# Altium project LCDTestor_LPC1788.PRJPCB
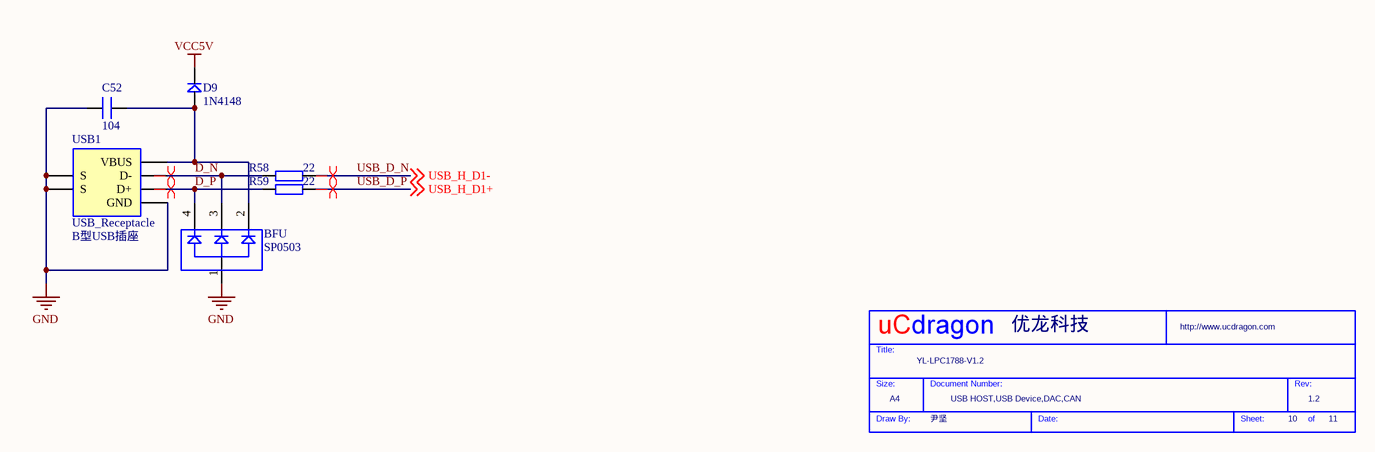
[diagram p0: 10)USB HOST,USB Device,.SchDoc]
9 sheets, 173 parts. Net scope: global (net labels, ports and power ports of the same name join across sheets).
Board file: LCDTestor_LPC1788.PcbDoc
Sheets:
  10)USB HOST,USB Device,.SchDoc
  07)Power,JTAG,RESET.SchDoc
  06)LCD.SchDoc
  05)NorFlash,NandFlash.SchDoc
  04)SDRAM.SchDoc
  03)CPU-3.SchDoc
  02)CPU-2.SchDoc
  01)CPU-1.SchDoc
  11)KEY,LED.SchDoc

## Sheet 10)USB HOST,USB Device,.SchDoc
size 297 x 209 mm

### Parts
(Parts that share a designator on the sheet are numbered #1, #2 ... from top to bottom, then left to right.)
*#1  Page Count: 11  Page Number: 10  Page Size: A4  Title: YL-LPC1788-V1.2  RevCode: 1.2  Doc: USB HOST,USB Device,DAC,CAN  Drawing: 尹坚  Company: 优龙科技  (hidden comment: My Title 0)  (graphical)
BFU  SP0503  [SOT143]
C52  104  [0603P]
D9  1N4148  [DIODE_SOP]
R58  22  [0603P]
R59  22  [0603P]
USB1  USB_Receptacle  value B型USB插座  [Micro_USB]

### Nets
GND: BFU.1 C52.1 USB1.4(GND) USB1.5(S) USB1.6(S)
VCC5V: D9.2
D_N: BFU.3 R58.1 USB1.2(D-)
D_P: BFU.4 R59.1 USB1.3(D+)
USB_D_N: R58.2 ; off-sheet USB_H_D1-  [also labelled USB_H_D1-]
USB_D_P: R59.2 ; off-sheet USB_H_D1+  [also labelled USB_H_D1+]
NetBFU_2: BFU.2 C52.2 D9.1 USB1.1(VBUS)

### Layout directives
differential pair: (no net found under the mark), USB_D_N, USB_D_P

### Notes on the sheet
- (in symbol My Title 0) Title:; Size:; Document Number:; Rev:; Draw By:; Date:; Sheet:; of

### Library data of the parts
BFU = SP0503: Capacitor; Published: *; Publisher: *; Manufacturer: *; Class: *; SubClass: *; Value: *
C52 = C_2
D9 = D
R58 R59 = R
USB1 = 300008272: B型USB插座，Series “B” Receptacles，Right Angle, T/H，4POS; Part name: USB插座; ID: 273; Part Number: 300008272; Part Type: USB插座; DataSheet: \\dsvr\1_研发团队\1_研发资源\HW\Lib_Datasheet\conn\usb\UC11123-LK1-4F_B_type.pdf
*#1 = My Title 0: Page Create Date: May 29, 2006; WebSite: http://www.ucdragon.com

## Sheet 07)Power,JTAG,RESET.SchDoc
size 297 x 209 mm
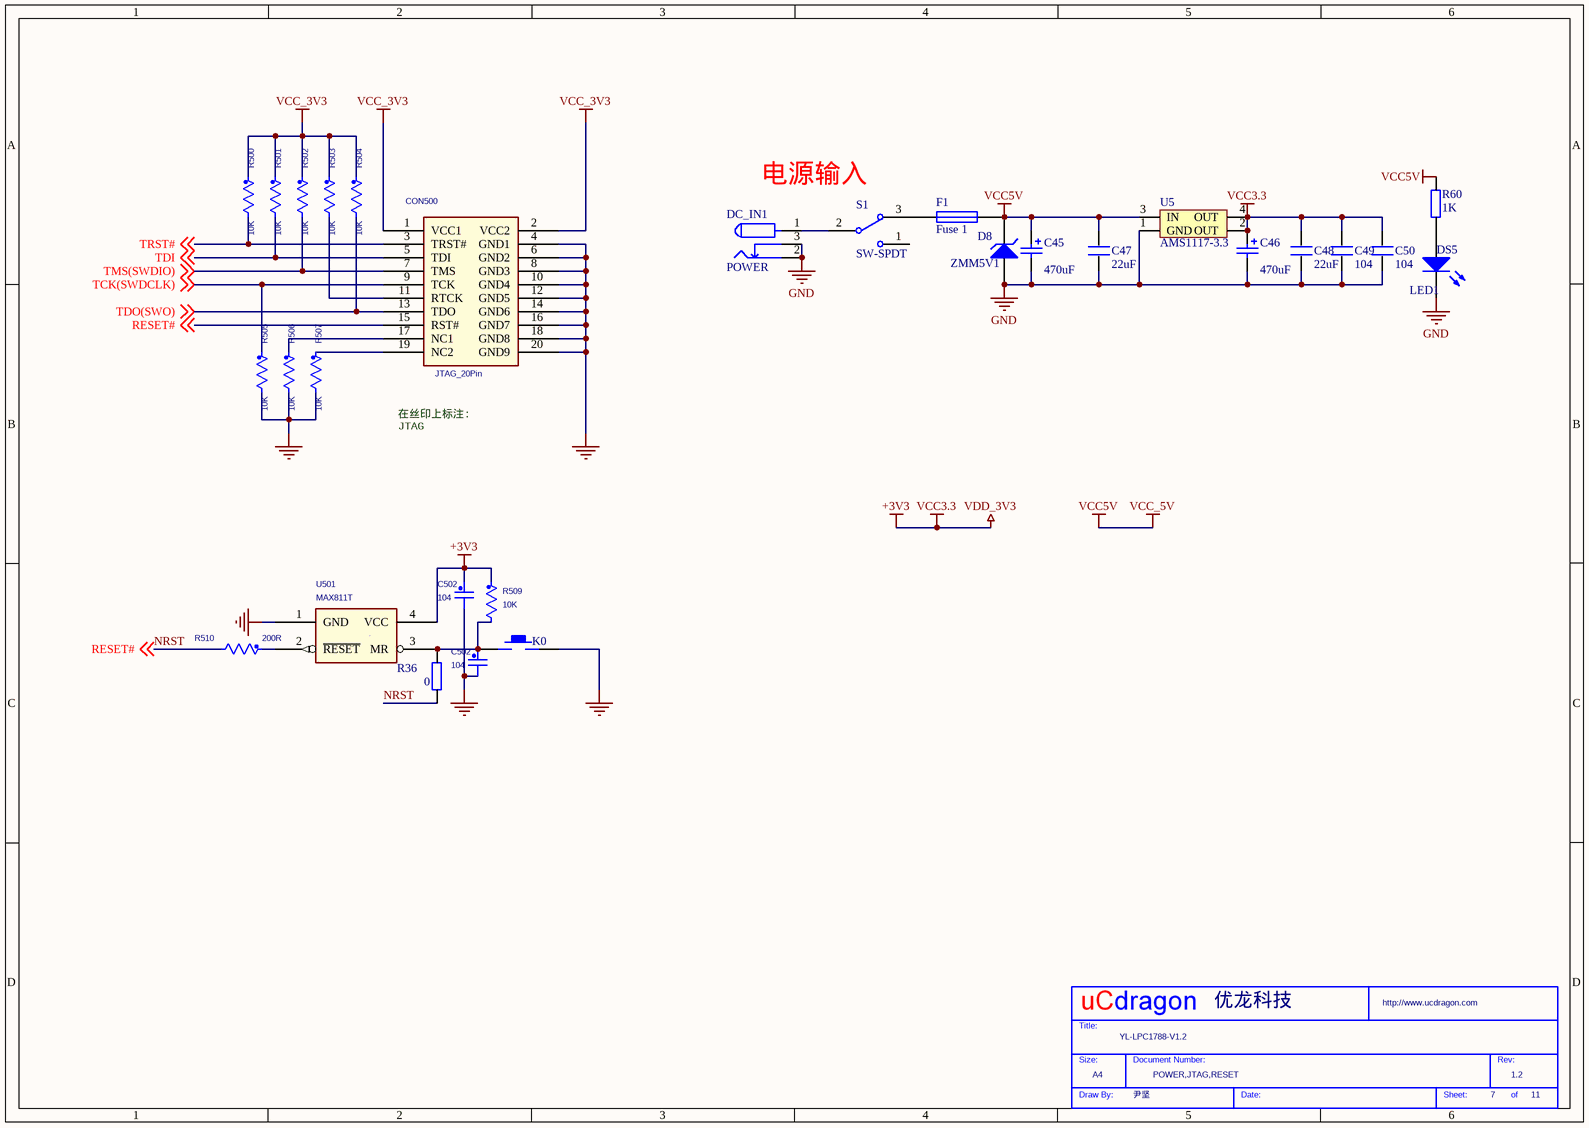
[diagram p1: 07)Power,JTAG,RESET.SchDoc]

### Parts
(Parts that share a designator on the sheet are numbered #1, #2 ... from top to bottom, then left to right.)
*#2  Page Count: 11  Page Number: 7  Page Size: A4  Title: YL-LPC1788-V1.2  RevCode: 1.2  Doc: POWER,JTAG,RESET  Drawing: 尹坚  Company: 优龙科技  (hidden comment: My Title 0)  (graphical)
C45  value 470uF  [7343]  (hidden comment: Cap Tantalum)
C46  value 470uF  [7343]  (hidden comment: Cap Tantalum)
C47  22uF  [0603P]
C48  22uF  [0603P]
C49  104  [0603P]
C50  104  [0603P]
C502#1  104  [0603P]
C502#2  104  [0603P]
CON500  JTAG_20Pin  [JTAG_20]
D8  ZMM5V1  [LL-34]
DC_IN1  POWER  [DC10B]
DS5  LED1  [SMDLED]
F1  Fuse 1  [0805]
K0  KEY_M  [K贴片]  (value not drawn)
R36  0  [0603P]
R60  1K  [0603P]
R500  10K  [0603P]
R501  10K  [0603P]
R502  10K  [0603P]
R503  10K  [0603P]
R504  10K  [0603P]
R505  10K  [0603P]
R506  10K  [0603P]
R507  10K  [0603P]
R509  10K  [0603P]
R510  200R  [0603P]
S1  SW-SPDT  [自锁开关6]
U5  AMS1117-3.3  [AMS1117]
U501  MAX811T  [SOT143]

### Nets
+3V3: C46.1 C48.2 C49.2 C50.2 C502#1.1 R509.1 U5.2(OUT) U5.4(OUT) U501.4(VCC)  [also labelled VCC3.3, VDD_3V3]
GND: C45.2 C46.2 C47.1 C48.1 C49.1 C50.1 D8.1(A) DC_IN1.2 DC_IN1.3 DS5.2(K) U5.1(GND)
GND_POWER: C502#1.2 C502#2.2 CON500.4(GND1) CON500.6(GND2) CON500.8(GND3) CON500.10(GND4) CON500.12(GND5) CON500.14(GND6) CON500.16(GND7) CON500.18(GND8) CON500.20(GND9) K0.2 R505.2 R506.2 R507.2 U501.1(GND)
VCC5V: C45.1 C47.2 D8.2(K) F1.2 R60.1 U5.3(IN)  [also labelled VCC_5V]
VCC_3V3: CON500.1(VCC1) CON500.2(VCC2) R500.1 R501.1 R502.1 R503.1 R504.1
NRST: CON500.15(RST#) R36.2 R510.2 ; off-sheet RESET#  [also labelled RESET#]
TCK(SWDCLK): CON500.9(TCK) R505.1 ; off-sheet TCK(SWDCLK)
TDI: CON500.5(TDI) R501.2 ; off-sheet TDI
TDO(SWO): CON500.13(TDO) R504.2 ; off-sheet TDO(SWO)
TMS(SWDIO): CON500.7(TMS) R502.2 ; off-sheet TMS(SWDIO)
TRST#: CON500.3(TRST#) R500.2 ; off-sheet TRST#
NetC502#2_1: C502#2.1 K0.1 R36.1 R509.2 U501.3(MR)
NetCON500_11: CON500.11(RTCK) R503.2
NetCON500_17: CON500.17(NC1) R506.1
NetCON500_19: CON500.19(NC2) R507.1
NetDC_IN1_1: DC_IN1.1 S1.2
NetDS5_1: DS5.1(A) R60.2
NetF1_1: F1.1 S1.3
NetR510_1: R510.1 U501.2(~{RESET})

Not connected (* = marked no-connect by the designer): S1 1

### Notes on the sheet
- 电源输入
- 在丝印上标注:
  JTAG
- (in symbol My Title 0) Title:; Size:; Document Number:; Rev:; Draw By:; Date:; Sheet:; of

### Library data of the parts
C45 C46 = Cap Tantalum: Polarized Capacitor (Surface Mount); Published: LatestRevisionDate; LatestRevisionDate: 2014-11-15; LatestRevisionNote: IPC-7351 Footprint Added.; PackageReference: C0805; Publisher: Am; PackageDescription: Chip Capacitor
C47-C50 = C_2
C502#1 C502#2 = C_Generic_Dup1: Dielectric: X7R; Mfg #1: KEMET; Voltage: 16V; P/N #1: C0603C104K4RAC; Toler.: 10%
D8 = D Zener: Zener Diode; Published: 8-Jun-2000; LatestRevisionDate: 17-Jul-2002; LatestRevisionNote: Re-released for DXP Platform.; PackageReference: DIODE-0.7; Publisher: Altium Limited
DC_IN1 = POW
DS5 = LED2: Typical RED, GREEN, YELLOW, AMBER GaAs LED; Published: 8-Jun-2000; LatestRevisionDate: 17-Jul-2002; LatestRevisionNote: Re-released for DXP Platform.; PackageDocument: Feb-2002; PackageReference: 3.2X1.6X1.1; Publisher: Altium Limited
F1 = Fuse 1: Fuse; Published: 8-Jun-2000; LatestRevisionDate: 17-Jul-2002; LatestRevisionNote: Re-released for DXP Platform.; PackageReference: PIN-W2/E2.8; Publisher: Altium Limited
R36 R60 = R
R500-R507 R509 R510 = R_Generic_Dup1: Toler.: 1%; Watts: 0.1W; P/N #1: CR10-1001F-T; Mfg #1: AVX
S1 = SW-SPDT: SPDT Subminiature Toggle Switch, Right Angle Mounting, Vertical Actuation; Published: 24-Mar-1999; LatestRevisionDate: 17-Dec-2003; LatestRevisionNote: Schematic revised, PCB Footprint replaced.; DatasheetVersion: 05-Dec-2000; PackageReference: TL36WW15050; Publisher: Altium Limited; ComponentLink1Description: Manufacturer Link; ComponentLink1URL: http://www.apem.com
U5 = AMS1117
U501 = UD215_1
*#2 = My Title 0: Page Create Date: May 29, 2006; WebSite: http://www.ucdragon.com

## Sheet 06)LCD.SchDoc
size 292 x 193 mm
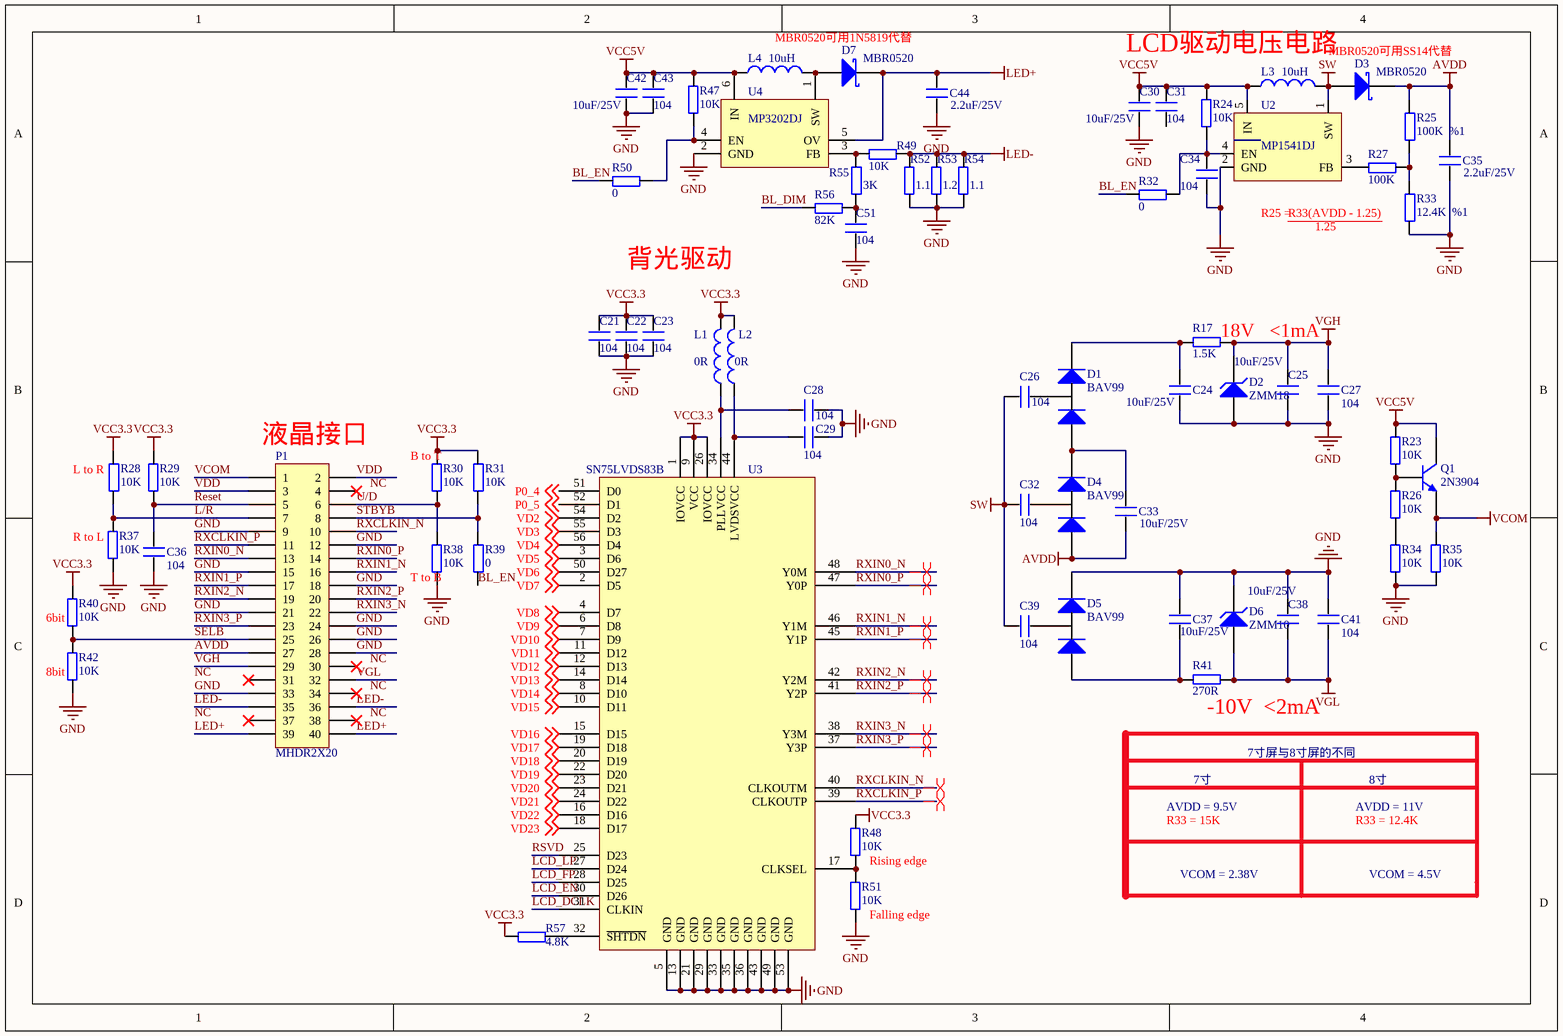
[diagram p2: 06)LCD.SchDoc]

### Parts
C21  104  [0603P]
C22  104  [0603P]
C23  104  [0603P]
C24  10uF/25V  [1206]
C25  10uF/25V  [1206]
C26  104  [0603P]
C27  104  [0603P]
C28  104  [0603P]
C29  104  [0603P]
C30  10uF/25V  [1206]
C31  104  [0603P]
C32  104  [0603P]
C33  10uF/25V  [1206]
C34  104  [0603P]
C35  2.2uF/25V  [1206]
C36  104  [0603P]
C37  10uF/25V  [1206]
C38  10uF/25V  [1206]
C39  104  [0603P]
C41  104  [0603P]
C42  10uF/25V  [1206]
C43  104  [0603P]
C44  2.2uF/25V  [1206]
C51  104  [0603P]
D1  BAV99  [SOT-23-3L]
D2  ZMM18  [LL-34]
D3  MBR0520  [DSO-C2/X2.3]
D4  BAV99  [SOT-23-3L]
D5  BAV99  [SOT-23-3L]
D6  ZMM10  [LL-34]
D7  MBR0520  [DSO-C2/X2.3]
L1  value 0R  [0603P]  (hidden comment: Inductor)
L2  value 0R  [0603P]  (hidden comment: Inductor)
L3  value 10uH  [1206]  (hidden comment: Inductor)
L4  value 10uH  [1206]  (hidden comment: Inductor)
P1  MHDR2X20  [FH12A-40S-0.5SH]
Q1  2N3904  [SOT-23-3L]
R17  1.5K  [0603P]
R23  10K  [0603P]
R24  10K  [0603P]
R25  100K  %1  [0603P]
R26  10K  [0603P]
R27  100K  [0603P]
R28  10K  [0603P]
R29  10K  [0603P]
R30  10K  [0603P]
R31  10K  [0603P]
R32  0  [0603P]
R33  12.4K  %1  [0603P]
R34  10K  [0603P]
R35  10K  [0603P]
R37  10K  [0603P]
R38  10K  [0603P]
R39  0  [0603P]
R40  10K  [0603P]
R41  270R  [0603P]
R42  10K  [0603P]
R47  10K  [0603P]
R48  10K  [0603P]
R49  10K  [0603P]
R50  0  [0603P]
R51  10K  [0603P]
R52  1.1  [0603P]
R53  1.2  [0603P]
R54  1.1  [0603P]
R55  3K  [0603P]
R56  82K  [0603P]
R57  4.8K  [0603P]
U2  MP1541DJ  [SOT-23-5L]
U3  SN75LVDS83B  [DGG056]
U4  MP3202DJ  [SOT-23-6L]

### Nets
AVDD: C33.2 C35.1 D3.2(K) D4.1(A) P1.27 R25.2
GND: C21.1 C22.1 C23.1 C24.2 C25.2 C27.2 C28.1 C29.1 C30.2 C34.1 C35.2 C36.1 C37.1 C38.1 C41.1 C42.2 C43.1 C44.2 C51.1 D2.1(A) D5.2(K) D6.2(K) P1.9 P1.12 P1.15 P1.18 P1.21 P1.24 P1.26 P1.28 P1.33 R33.1 R34.2 R35.2 R37.2 R38.2 R42.2 R51.2 R52.2 R53.2 R54.2 U2.2(GND) U3.5(GND) U3.13(GND) U3.21(GND) U3.29(GND) U3.33(GND) U3.35(GND) U3.36(GND) U3.43(GND) U3.49(GND) U3.53(GND) U4.2(GND)
LED+: C44.1 D7.2(K) P1.39 P1.40 U4.5(OV)
LED-: P1.35 P1.36 R49.2 R52.1 R53.1 R54.1
SW: C26.2 C32.1 C39.1 D3.1(A) L3.2 U2.1(SW)
VCC3.3: C21.2 C22.2 C23.2 L1.2 L2.2 R28.2 R29.1 R30.1 R31.2 R40.1 R48.1 R57.1 U3.1(IOVCC) U3.9(VCC) U3.26(IOVCC)  [project net +3V3]
VCC5V: C30.1 C31.2 C42.1 C43.2 L3.1 L4.1 Q1.3(C) R23.1 R24.1 R47.1 U2.5(IN) U4.6(IN)
VCOM: P1.1 Q1.2(E) R35.1
VGH: C25.1 C27.1 D2.2(K) P1.29 R17.1
VGL: C38.2 C41.2 D6.1(A) P1.32 R41.1
BL_DIM: R56.1
BL_EN: R32.1 R39.1 R50.1
L/R: P1.7 R28.1 R37.1
LCD_DCLK: U3.31(CLKIN)
LCD_EN: U3.30(D26)
LCD_FP: U3.28(D25)
LCD_LP: U3.27(D24)
P0_4: U3.51(D0) ; off-sheet P0_4
P0_5: U3.52(D1) ; off-sheet P0_5
Reset: C36.2 P1.5 R29.2
RSVD: U3.25(D23)
RXCLKIN_N: P1.10 U3.40(CLKOUTM)
RXCLKIN_P: P1.11 U3.39(CLKOUTP)
RXIN0_N: P1.13 U3.48(Y0M)
RXIN0_P: P1.14 U3.47(Y0P)
RXIN1_N: P1.16 U3.46(Y1M)
RXIN1_P: P1.17 U3.45(Y1P)
RXIN2_N: P1.19 U3.42(Y2M)
RXIN2_P: P1.20 U3.41(Y2P)
RXIN3_N: P1.22 U3.38(Y3M)
RXIN3_P: P1.23 U3.37(Y3P)
SELB: P1.25 R40.2 R42.1
STBYB: P1.8 R31.1 R39.2
U/D: P1.6 R30.2 R38.1
VD2: U3.54(D2) ; off-sheet VD2
VD3: U3.55(D3) ; off-sheet VD3
VD4: U3.56(D4) ; off-sheet VD4
VD5: U3.3(D6) ; off-sheet VD5
VD6: U3.50(D27) ; off-sheet VD6
VD7: U3.2(D5) ; off-sheet VD7
VD8: U3.4(D7) ; off-sheet VD8
VD9: U3.6(D8) ; off-sheet VD9
VD10: U3.7(D9) ; off-sheet VD10
VD11: U3.11(D12) ; off-sheet VD11
VD12: U3.12(D13) ; off-sheet VD12
VD13: U3.14(D14) ; off-sheet VD13
VD14: U3.8(D10) ; off-sheet VD14
VD15: U3.10(D11) ; off-sheet VD15
VD16: U3.15(D15) ; off-sheet VD16
VD17: U3.19(D18) ; off-sheet VD17
VD18: U3.20(D19) ; off-sheet VD18
VD19: U3.22(D20) ; off-sheet VD19
VD20: U3.23(D21) ; off-sheet VD20
VD21: U3.24(D22) ; off-sheet VD21
VD22: U3.16(D16) ; off-sheet VD22
VD23: U3.18(D17) ; off-sheet VD23
VDD: P1.2 P1.3
NetC24_1: C24.1 D1.2(K) R17.2
NetC26_1: C26.1 D1.3(A)
NetC28_2: C28.2 L1.1 U3.34(PLLVCC)
NetC29_2: C29.2 L2.1 U3.44(LVDSVCC)
NetC32_2: C32.2 D4.3(A)
NetC33_1: C33.1 D1.1(A) D4.2(K)
NetC34_2: C34.2 R24.2 R32.2 U2.4(EN)
NetC37_2: C37.2 D5.1(A) R41.2
NetC39_2: C39.2 D5.3(A)
NetC51_2: C51.2 R55.1 R56.2
NetD7_1: D7.1(A) L4.2 U4.1(SW)
NetQ1_1: Q1.1(B) R23.2 R26.1
NetR25_1: R25.1 R27.2 R33.2
NetR26_2: R26.2 R34.1
NetR27_1: R27.1 U2.3(FB)
NetR47_2: R47.2 R50.2 U4.4(EN)
NetR48_2: R48.2 R51.1 U3.17(CLKSEL)
NetR49_1: R49.1 R55.2 U4.3(FB)
NetR57_2: R57.2 U3.32(~{SHTDN})

Not connected (* = marked no-connect by the designer): C31 1; P1 4* 30* 31* 34* 37* 38*

### Layout directives
differential pair: RXCLKIN_N, RXCLKIN_P, RXIN0_N, RXIN0_P, RXIN1_N, RXIN1_P, RXIN2_N, RXIN2_P, RXIN3_N, RXIN3_P

### Notes on the sheet
- MBR0520可用1N5819代替
- LCD驱动电压电路
- MBR0520可用SS14代替
- R25 =
- R33(AVDD - 1.25)
- 1.25
- 背光驱动
- (near R17) 18V   <1mA
- (near P1) 液晶接口
- (near R28) L to R
- (near R30) B to T
- (near R37) R to L
- (near R38) T to B
- (near R40) 6bit
- (near R42) 8bit
- (near R41) -10V  <2mA
- 7寸
- 7寸屏与8寸屏的不同
- 8寸
- AVDD = 9.5V
- R33 = 15K
- AVDD = 11V
- R33 = 12.4K
- Rising edge
- (near R51) Falling edge
- VCOM = 2.38V
- VCOM = 4.5V
- Labels drawn without touching a wire or pin: NC

### Library data of the parts
C21-C39 C41-C44 C51 = C
D2 D6 = D Zener: Zener Diode; Published: 8-Jun-2000; LatestRevisionDate: 17-Jul-2002; LatestRevisionNote: Re-released for DXP Platform.; PackageReference: DIODE-0.7; Publisher: Altium Limited
D3 D7 = D Schottky: Schottky Diode; Published: 8-Jun-2000; LatestRevisionDate: 17-Jul-2002; LatestRevisionNote: Re-released for DXP Platform.; PackageReference: SMB; Publisher: Altium Limited; Code_JEDEC: DO-214-AA
L1-L4 = Inductor: Code_IEC: 1005; Published: 8-Jun-2000; LatestRevisionDate: 29-May-2009; LatestRevisionNote: IPC-7351 Footprint Added.; PackageReference: 0402-A; Publisher: Altium Limited; PackageDescription: Chip Inductor; Code_JEITA: 0402
P1 = MHDR2X20: Header, 20-Pin, Dual row; LatestRevisionDate: 17-Jul-2002; LatestRevisionNote: Re-released for DXP Platform.; Publisher: Altium Limited
Q1 = 2N3904: NPN General Purpose Amplifier; Published: 8-Jun-2000; LatestRevisionDate: 15-Jan-2003; LatestRevisionNote: PCB Footprint 'BCY-W3/D4.7' replaced; DatasheetVersion: 1997; PackageVersion: Sep-1998; PackageReference: TO-92A; Publisher: Altium Limited; Code_JEDEC: TO-92A; ComponentLink1Description: Manufacturer Link; ComponentLink1URL: http://www.fairchildsemi.com/; ComponentLink2Description: Datasheet; ComponentLink2URL: http://www.fairchildsemi.com/ds/2N%2F2N3904.pdf
R17 R23-R35 R37-R42 R47-R57 = R
U2 = MP1541
U4 = MP3202

## Sheet 05)NorFlash,NandFlash.SchDoc
size 297 x 209 mm
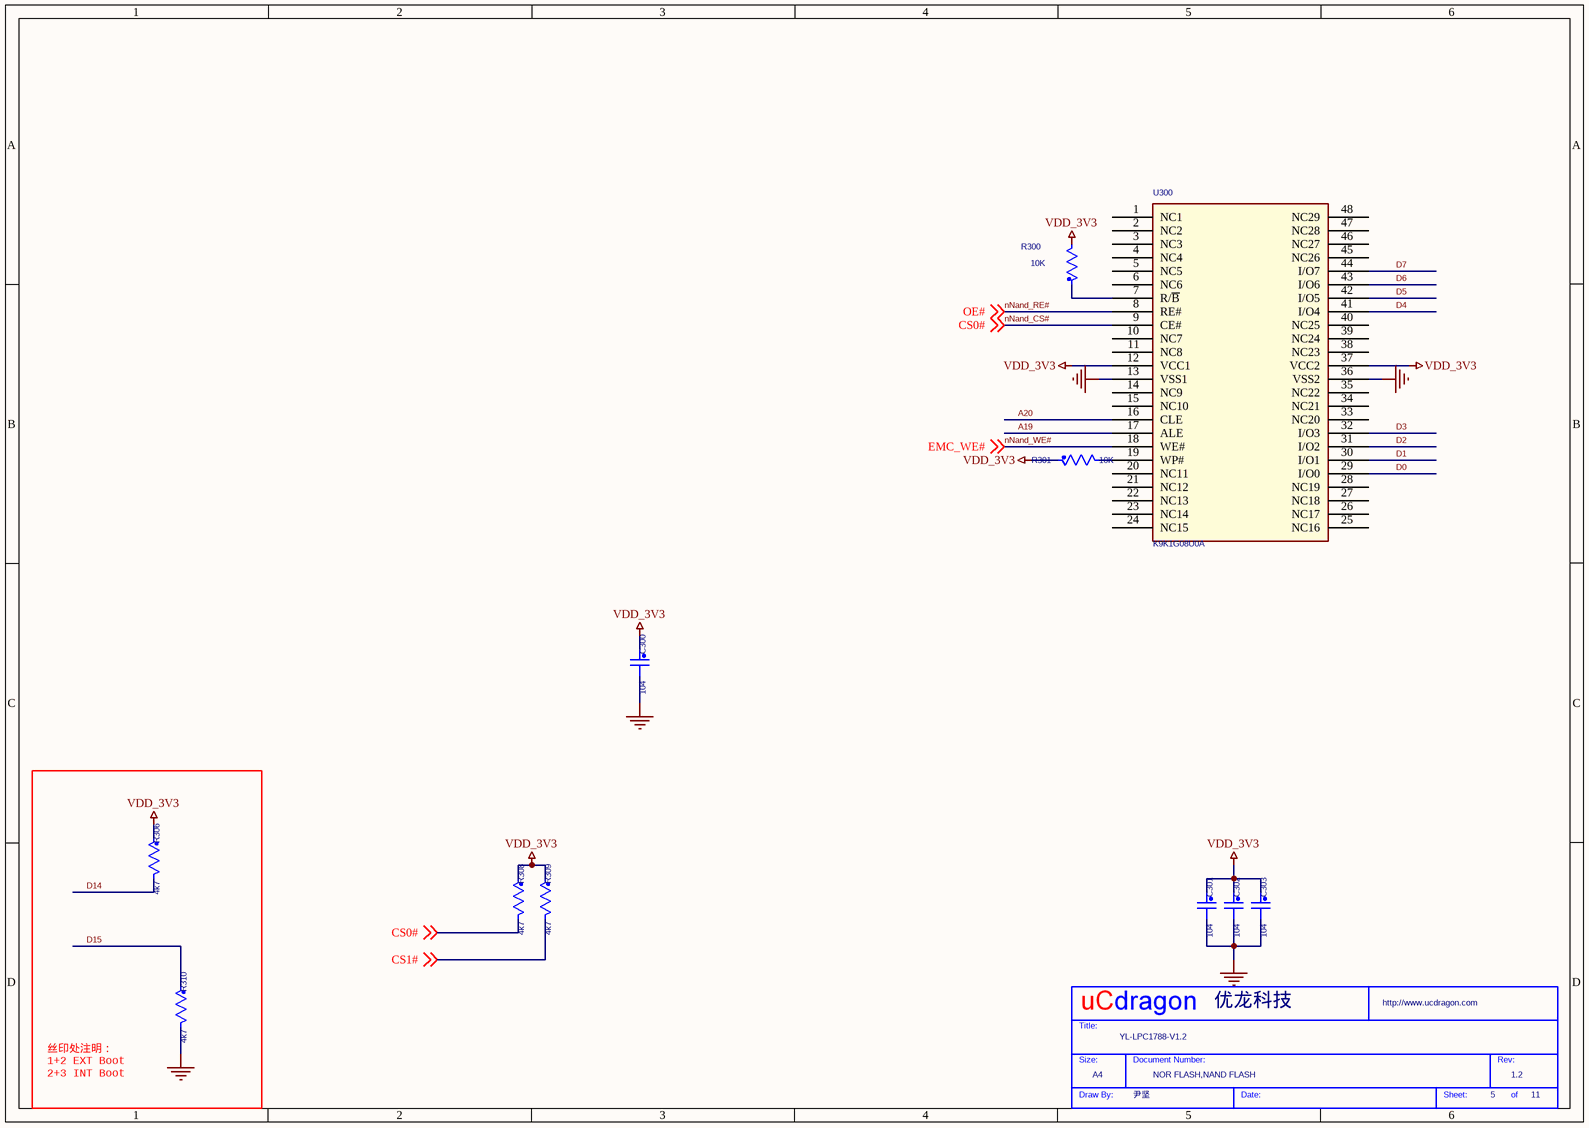
[diagram p3: 05)NorFlash,NandFlash.SchDoc]

### Parts
(Parts that share a designator on the sheet are numbered #1, #2 ... from top to bottom, then left to right.)
*#3  Page Count: 11  Page Number: 5  Page Size: A4  Title: YL-LPC1788-V1.2  RevCode: 1.2  Doc: NOR FLASH,NAND FLASH  Drawing: 尹坚  Company: 优龙科技  (hidden comment: My Title 0)  (graphical)
C300  104  [0603P]
C301  104  [0603P]
C302  104  [0603P]
C303  104  [0603P]
R300  10K  [0603P]
R301  10K  [0603P]
R306  4k7  [0603P]
R308  4k7  [0603P]
R309  4k7  [0603P]
R310  4k7  [0603P]
U300  K9K1G08U0A  [TSOP48]

### Nets
GND_POWER: C300.2 C301.2 C302.2 C303.2 R310.2 U300.13(VSS1) U300.36(VSS2)
VDD_3V3: C300.1 C301.1 C302.1 C303.1 R300.2 R301.1 R306.1 R308.1 R309.1 U300.12(VCC1) U300.37(VCC2)  [project net +3V3]
A19: U300.17(ALE)
A20: U300.16(CLE)
CS1#: R309.2 ; off-sheet CS1#
D0: U300.29(I/O0)
D1: U300.30(I/O1)
D2: U300.31(I/O2)
D3: U300.32(I/O3)
D4: U300.41(I/O4)
D5: U300.42(I/O5)
D6: U300.43(I/O6)
D7: U300.44(I/O7)
D14: R306.2
D15: R310.1
EMC_WE#: U300.18(WE#) ; off-sheet EMC_WE#  [also labelled nNand_WE#]
nNand_CS#: R308.2 U300.9(CE#) ; off-sheet CS0#  [also labelled CS0#]
nNand_RE#: U300.8(RE#) ; off-sheet OE#  [also labelled OE#]
NetR300_1: R300.1 U300.7(R/~{B})
NetR301_2: R301.2 U300.19(WP#)

Not connected (* = marked no-connect by the designer): U300 1(NC1) 2(NC2) 3(NC3) 4(NC4) 5(NC5) 6(NC6) 10(NC7) 11(NC8) 14(NC9) 15(NC10) 20(NC11) 21(NC12) 22(NC13) 23(NC14) 24(NC15) 25(NC16) 26(NC17) 27(NC18) 28(NC19) 33(NC20) 34(NC21) 35(NC22) 38(NC23) 39(NC24) 40(NC25) 45(NC26) 46(NC27) 47(NC28) 48(NC29)

### Notes on the sheet
- (near R310) 丝印处注明：
  1+2 EXT Boot
  2+3 INT Boot
- (in symbol My Title 0) Title:; Size:; Document Number:; Rev:; Draw By:; Date:; Sheet:; of

### Library data of the parts
C300-C303 = C_Generic_Dup2
R300 R301 R306 R308-R310 = R_Generic_Dup1
*#3 = My Title 0: Page Create Date: May 29, 2006; WebSite: http://www.ucdragon.com

## Sheet 04)SDRAM.SchDoc
size 297 x 209 mm
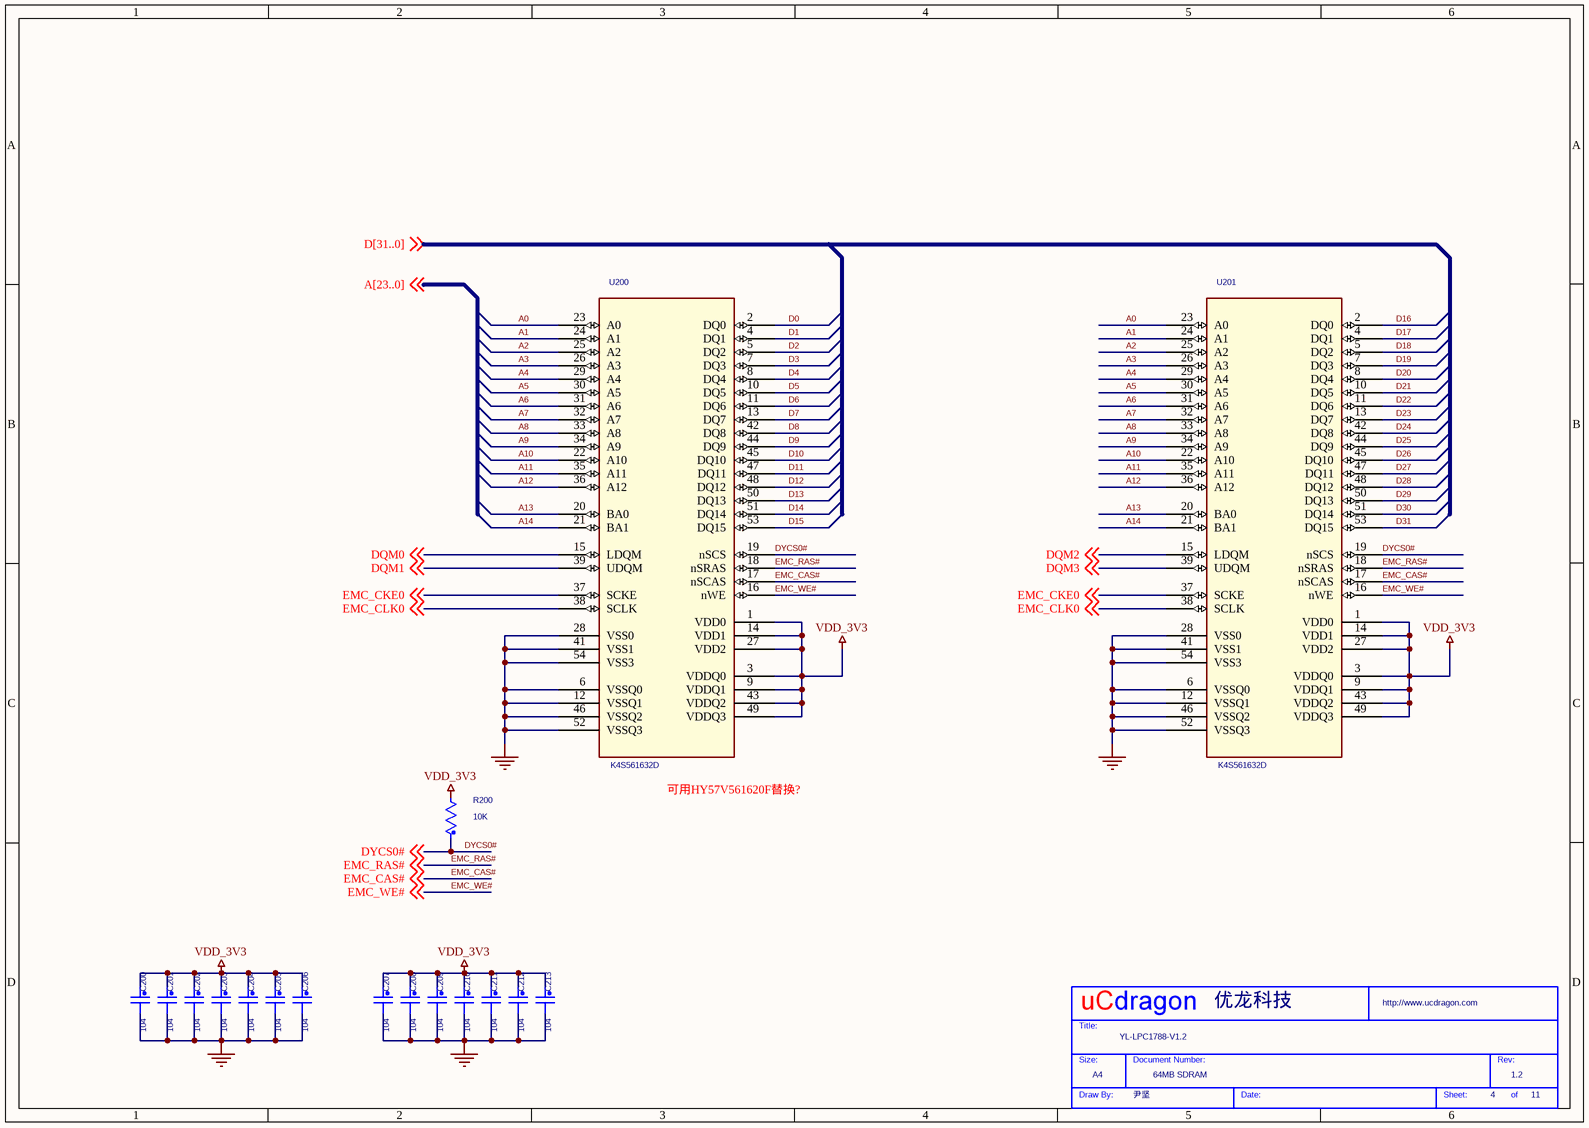
[diagram p4: 04)SDRAM.SchDoc]

### Parts
(Parts that share a designator on the sheet are numbered #1, #2 ... from top to bottom, then left to right.)
*#4  Page Count: 11  Page Number: 4  Page Size: A4  Title: YL-LPC1788-V1.2  RevCode: 1.2  Doc: 64MB SDRAM  Drawing: 尹坚  Company: 优龙科技  (hidden comment: My Title 0)  (graphical)
C200  104  [0603P]
C201  104  [0603P]
C202  104  [0603P]
C203  104  [0603P]
C204  104  [0603P]
C205  104  [0603P]
C206  104  [0603P]
C207  104  [0603P]
C208  104  [0603P]
C209  104  [0603P]
C210  104  [0603P]
C211  104  [0603P]
C212  104  [0603P]
C213  104  [0603P]
R200  10K  [0603P]
U200  K4S561632D  [54_TSOP2_400AF_L]
U201  K4S561632D  [54_TSOP2_400AF_L]

### Nets
GND_POWER: C200.2 C201.2 C202.2 C203.2 C204.2 C205.2 C206.2 C207.2 C208.2 C209.2 C210.2 C211.2 C212.2 C213.2 U200.6(VSSQ0) U200.12(VSSQ1) U200.28(VSS0) U200.41(VSS1) U200.46(VSSQ2) U200.52(VSSQ3) U200.54(VSS3) U201.6(VSSQ0) U201.12(VSSQ1) U201.28(VSS0) U201.41(VSS1) U201.46(VSSQ2) U201.52(VSSQ3) U201.54(VSS3)
VDD_3V3: C200.1 C201.1 C202.1 C203.1 C204.1 C205.1 C206.1 C207.1 C208.1 C209.1 C210.1 C211.1 C212.1 C213.1 R200.2 U200.1(VDD0) U200.3(VDDQ0) U200.9(VDDQ1) U200.14(VDD1) U200.27(VDD2) U200.43(VDDQ2) U200.49(VDDQ3) U201.1(VDD0) U201.3(VDDQ0) U201.9(VDDQ1) U201.14(VDD1) U201.27(VDD2) U201.43(VDDQ2) U201.49(VDDQ3)  [project net +3V3]
A0: U200.23(A0) U201.23(A0)
A1: U200.24(A1) U201.24(A1)
A2: U200.25(A2) U201.25(A2)
A3: U200.26(A3) U201.26(A3)
A4: U200.29(A4) U201.29(A4)
A5: U200.30(A5) U201.30(A5)
A6: U200.31(A6) U201.31(A6)
A7: U200.32(A7) U201.32(A7)
A8: U200.33(A8) U201.33(A8)
A9: U200.34(A9) U201.34(A9)
A10: U200.22(A10) U201.22(A10)
A11: U200.35(A11) U201.35(A11)
A12: U200.36(A12) U201.36(A12)
A13: U200.20(BA0) U201.20(BA0)
A14: U200.21(BA1) U201.21(BA1)
D0: U200.2(DQ0)
D1: U200.4(DQ1)
D2: U200.5(DQ2)
D3: U200.7(DQ3)
D4: U200.8(DQ4)
D5: U200.10(DQ5)
D6: U200.11(DQ6)
D7: U200.13(DQ7)
D8: U200.42(DQ8)
D9: U200.44(DQ9)
D10: U200.45(DQ10)
D11: U200.47(DQ11)
D12: U200.48(DQ12)
D13: U200.50(DQ13)
D14: U200.51(DQ14)
D15: U200.53(DQ15)
D16: U201.2(DQ0)
D17: U201.4(DQ1)
D18: U201.5(DQ2)
D19: U201.7(DQ3)
D20: U201.8(DQ4)
D21: U201.10(DQ5)
D22: U201.11(DQ6)
D23: U201.13(DQ7)
D24: U201.42(DQ8)
D25: U201.44(DQ9)
D26: U201.45(DQ10)
D27: U201.47(DQ11)
D28: U201.48(DQ12)
D29: U201.50(DQ13)
D30: U201.51(DQ14)
D31: U201.53(DQ15)
DQM0: U200.15(LDQM) ; off-sheet DQM0
DQM1: U200.39(UDQM) ; off-sheet DQM1
DQM2: U201.15(LDQM) ; off-sheet DQM2
DQM3: U201.39(UDQM) ; off-sheet DQM3
DYCS0#: R200.1 U200.19(nSCS) U201.19(nSCS) ; off-sheet DYCS0#
EMC_CAS#: U200.17(nSCAS) U201.17(nSCAS) ; off-sheet EMC_CAS#
EMC_CKE0: U200.37(SCKE) U201.37(SCKE) ; off-sheet EMC_CKE0
EMC_CLK0: U200.38(SCLK) U201.38(SCLK) ; off-sheet EMC_CLK0
EMC_RAS#: U200.18(nSRAS) U201.18(nSRAS) ; off-sheet EMC_RAS#
EMC_WE#: U200.16(nWE) U201.16(nWE) ; off-sheet EMC_WE#

### Notes on the sheet
- 可用HY57V561620F替换?
- (in symbol My Title 0) Title:; Size:; Document Number:; Rev:; Draw By:; Date:; Sheet:; of

### Library data of the parts
C200-C213 = C_Generic_Dup2
R200 = R_Generic_Dup1
*#4 = My Title 0: Page Create Date: May 29, 2006; WebSite: http://www.ucdragon.com

## Sheet 03)CPU-3.SchDoc
size 297 x 209 mm
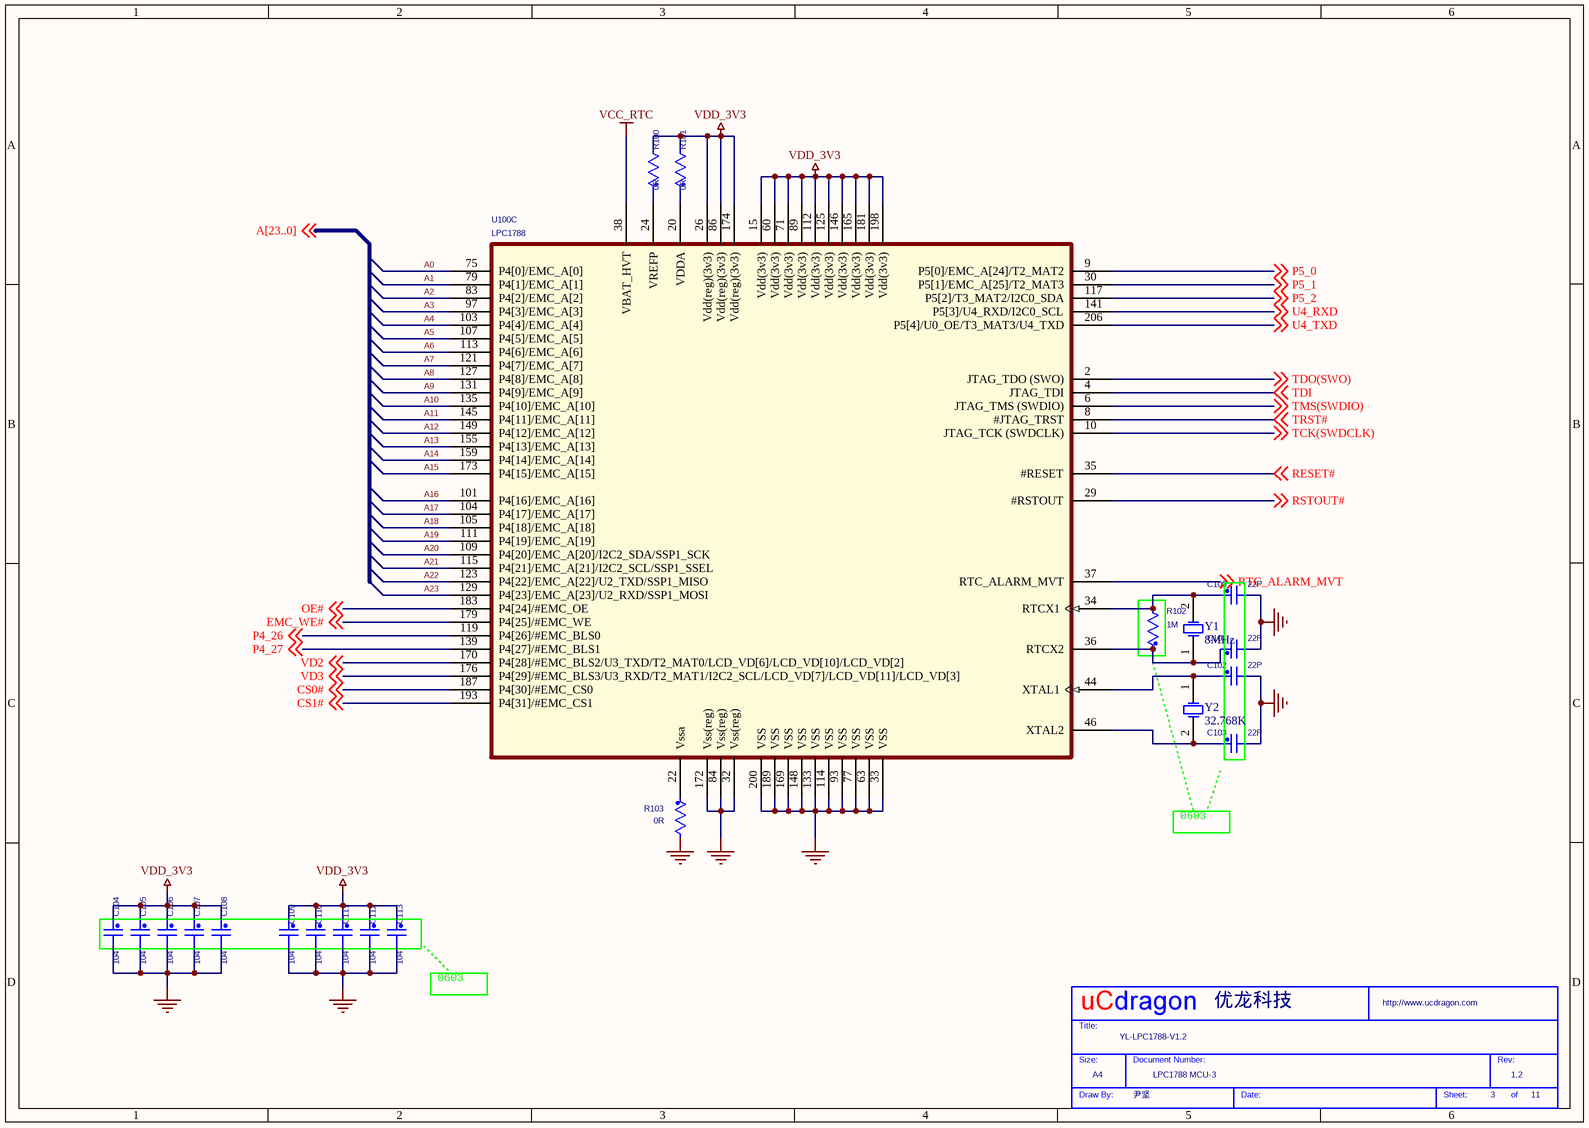
[diagram p5: 03)CPU-3.SchDoc]

### Parts
(Parts that share a designator on the sheet are numbered #1, #2 ... from top to bottom, then left to right.)
*#5  Page Count: 11  Page Number: 3  Page Size: A4  Title: YL-LPC1788-V1.2  RevCode: 1.2  Doc: LPC1788 MCU-3  Drawing: 尹坚  Company: 优龙科技  (hidden comment: My Title 0)  (graphical)
C100  22P  [0603P]
C101  22P  [0603P]
C102  22P  [0603P]
C103  22P  [0603P]
C104  104  [0603P]
C105  104  [0603P]
C106  104  [0603P]
C107  104  [0603P]
C108  104  [0603P]
C109  104  [0603P]
C110  104  [0603P]
C111  104  [0603P]
C112  104  [0603P]
C113  104  [0603P]
R100  0R  [0603P]
R101  0R  [0603P]
R102  1M  [0603P]
R103  0R  [0603P]
U100  LPC1788  [LQFP208_28X28X05P]  (part C of 3)
Y1  8MHz  [SMD2_50X32]
Y2  32.768K  [XTAL32]

### Nets
GND_POWER: C100.2 C101.2 C102.2 C103.2 C104.2 C105.2 C106.2 C107.2 C108.2 C109.2 C110.2 C111.2 C112.2 C113.2 R103.2 U100.32(Vss(reg)) U100.33(VSS) U100.63(VSS) U100.77(VSS) U100.84(Vss(reg)) U100.93(VSS) U100.114(VSS) U100.133(VSS) U100.148(VSS) U100.169(VSS) U100.172(Vss(reg)) U100.189(VSS) U100.200(VSS)
VCC_RTC: U100.38(VBAT_HVT)
VDD_3V3: C104.1 C105.1 C106.1 C107.1 C108.1 C109.1 C110.1 C111.1 C112.1 C113.1 R100.2 R101.2 U100.15(Vdd(3v3)) U100.26(Vdd(reg)(3v3)) U100.60(Vdd(3v3)) U100.71(Vdd(3v3)) U100.86(Vdd(reg)(3v3)) U100.89(Vdd(3v3)) U100.112(Vdd(3v3)) U100.125(Vdd(3v3)) U100.146(Vdd(3v3)) U100.165(Vdd(3v3)) U100.174(Vdd(reg)(3v3)) U100.181(Vdd(3v3)) U100.198(Vdd(3v3))  [project net +3V3]
A0: U100.75(P4[0]/EMC_A[0])
A1: U100.79(P4[1]/EMC_A[1])
A2: U100.83(P4[2]/EMC_A[2])
A3: U100.97(P4[3]/EMC_A[3])
A4: U100.103(P4[4]/EMC_A[4])
A5: U100.107(P4[5]/EMC_A[5])
A6: U100.113(P4[6]/EMC_A[6])
A7: U100.121(P4[7]/EMC_A[7])
A8: U100.127(P4[8]/EMC_A[8])
A9: U100.131(P4[9]/EMC_A[9])
A10: U100.135(P4[10]/EMC_A[10])
A11: U100.145(P4[11]/EMC_A[11])
A12: U100.149(P4[12]/EMC_A[12])
A13: U100.155(P4[13]/EMC_A[13])
A14: U100.159(P4[14]/EMC_A[14])
A15: U100.173(P4[15]/EMC_A[15])
A16: U100.101(P4[16]/EMC_A[16])
A17: U100.104(P4[17]/EMC_A[17])
A18: U100.105(P4[18]/EMC_A[18])
A19: U100.111(P4[19]/EMC_A[19])
A20: U100.109(P4[20]/EMC_A[20]/I2C2_SDA/SSP1_SCK)
A21: U100.115(P4[21]/EMC_A[21]/I2C2_SCL/SSP1_SSEL)
A22: U100.123(P4[22]/EMC_A[22]/U2_TXD/SSP1_MISO)
A23: U100.129(P4[23]/EMC_A[23]/U2_RXD/SSP1_MOSI)
CS0#: U100.187(P4[30]/#EMC_CS0) ; off-sheet CS0#  [project net nNand_CS#]
CS1#: U100.193(P4[31]/#EMC_CS1) ; off-sheet CS1#
EMC_WE#: U100.179(P4[25]/#EMC_WE) ; off-sheet EMC_WE#
OE#: U100.183(P4[24]/#EMC_OE) ; off-sheet OE#  [project net nNand_RE#]
P4_26: U100.119(P4[26]/#EMC_BLS0) ; off-sheet P4_26
P4_27: U100.139(P4[27]/#EMC_BLS1) ; off-sheet P4_27
P5_0: U100.9(P5[0]/EMC_A[24]/T2_MAT2) ; off-sheet P5_0
P5_1: U100.30(P5[1]/EMC_A[25]/T2_MAT3) ; off-sheet P5_1
P5_2: U100.117(P5[2]/T3_MAT2/I2C0_SDA) ; off-sheet P5_2
RESET#: U100.35(#RESET) ; off-sheet RESET#  [project net NRST]
RSTOUT#: U100.29(#RSTOUT) ; off-sheet RSTOUT#
RTC_ALARM_MVT: U100.37(RTC_ALARM_MVT) ; off-sheet RTC_ALARM_MVT
TCK(SWDCLK): U100.10(JTAG_TCK_(SWDCLK)) ; off-sheet TCK(SWDCLK)
TDI: U100.4(JTAG_TDI) ; off-sheet TDI
TDO(SWO): U100.2(JTAG_TDO_(SWO)) ; off-sheet TDO(SWO)
TMS(SWDIO): U100.6(JTAG_TMS_(SWDIO)) ; off-sheet TMS(SWDIO)
TRST#: U100.8(#JTAG_TRST) ; off-sheet TRST#
U4_RXD: U100.141(P5[3]/U4_RXD/I2C0_SCL) ; off-sheet U4_RXD
U4_TXD: U100.206(P5[4]/U0_OE/T3_MAT3/U4_TXD) ; off-sheet U4_TXD
VD2: U100.170(P4[28]/#EMC_BLS2/U3_TXD/T2_MAT0/LCD_VD[6]/LCD_VD[10]/LCD_VD[2]) ; off-sheet VD2
VD3: U100.176(P4[29]/#EMC_BLS3/U3_RXD/T2_MAT1/I2C2_SCL/LCD_VD[7]/LCD_VD[11]/LCD_VD[3]) ; off-sheet VD3
NetC100_1: C100.1 R102.2 U100.34(RTCX1) Y1.2(OSC2)
NetC101_1: C101.1 R102.1 U100.36(RTCX2) Y1.1(OSC1)
NetC102_1: C102.1 U100.44(XTAL1) Y2.1(OSC1)
NetC103_1: C103.1 U100.46(XTAL2) Y2.2(OSC2)
NetR100_1: R100.1 U100.24(VREFP)
NetR101_1: R101.1 U100.20(VDDA)
NetR103_1: R103.1 U100.22(Vssa)

### Notes on the sheet
- 0603
- (in symbol My Title 0) Title:; Size:; Document Number:; Rev:; Draw By:; Date:; Sheet:; of

### Library data of the parts
C100-C113 = C_Generic_Dup2
R100-R103 = R_Generic_Dup2
Y1 = XTAL: Crystal Oscillator; Published: 8-Jun-2000; LatestRevisionDate: 17-Jul-2002; LatestRevisionNote: Re-released for DXP Platform.; Publisher: Altium Limited
Y2 = XTAL_1: Crystal Oscillator; Published: 8-Jun-2000; LatestRevisionDate: 17-Jul-2002; LatestRevisionNote: Re-released for DXP Platform.; Publisher: Altium Limited
*#5 = My Title 0: Page Create Date: May 29, 2006; WebSite: http://www.ucdragon.com

## Sheet 02)CPU-2.SchDoc
size 297 x 209 mm
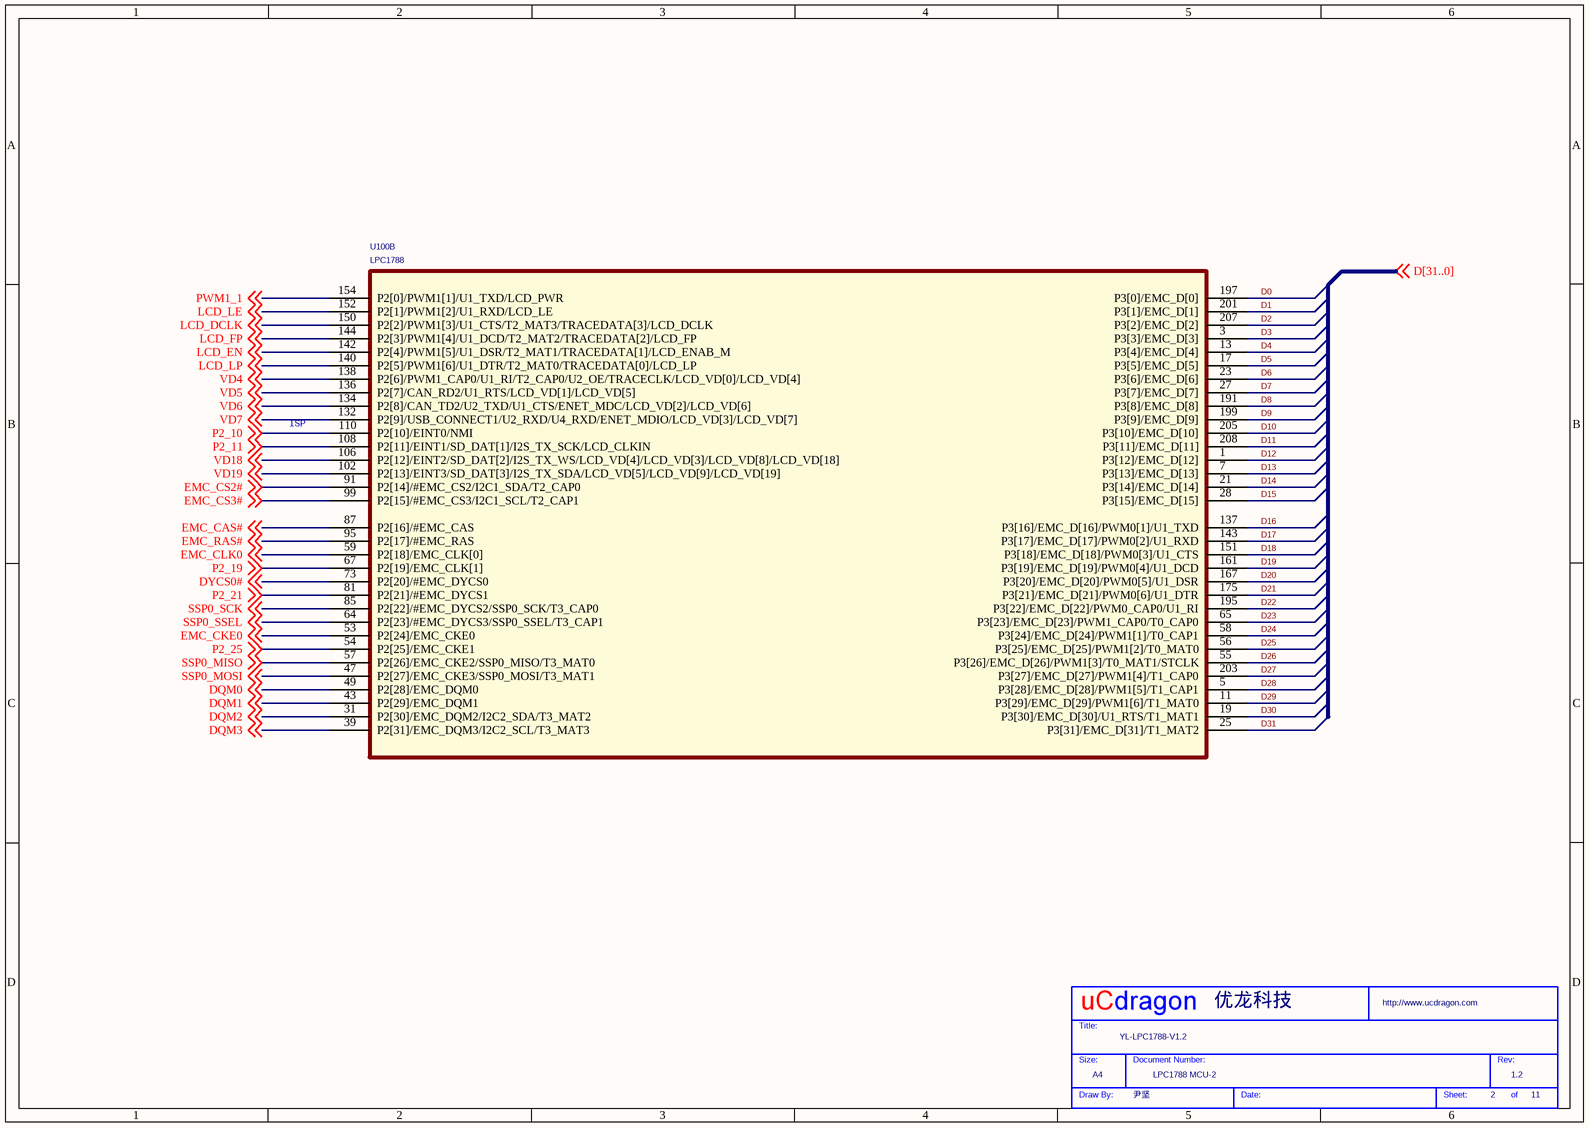
[diagram p6: 02)CPU-2.SchDoc]

### Parts
(Parts that share a designator on the sheet are numbered #1, #2 ... from top to bottom, then left to right.)
*#6  Page Count: 11  Page Number: 2  Page Size: A4  Title: YL-LPC1788-V1.2  RevCode: 1.2  Doc: LPC1788 MCU-2  Drawing: 尹坚  Company: 优龙科技  (hidden comment: My Title 0)  (graphical)
U100  LPC1788  [LQFP208_28X28X05P]  (part B of 3)

### Nets
D0: U100.197(P3[0]/EMC_D[0])
D1: U100.201(P3[1]/EMC_D[1])
D2: U100.207(P3[2]/EMC_D[2])
D3: U100.3(P3[3]/EMC_D[3])
D4: U100.13(P3[4]/EMC_D[4])
D5: U100.17(P3[5]/EMC_D[5])
D6: U100.23(P3[6]/EMC_D[6])
D7: U100.27(P3[7]/EMC_D[7])
D8: U100.191(P3[8]/EMC_D[8])
D9: U100.199(P3[9]/EMC_D[9])
D10: U100.205(P3[10]/EMC_D[10])
D11: U100.208(P3[11]/EMC_D[11])
D12: U100.1(P3[12]/EMC_D[12])
D13: U100.7(P3[13]/EMC_D[13])
D14: U100.21(P3[14]/EMC_D[14])
D15: U100.28(P3[15]/EMC_D[15])
D16: U100.137(P3[16]/EMC_D[16]/PWM0[1]/U1_TXD)
D17: U100.143(P3[17]/EMC_D[17]/PWM0[2]/U1_RXD)
D18: U100.151(P3[18]/EMC_D[18]/PWM0[3]/U1_CTS)
D19: U100.161(P3[19]/EMC_D[19]/PWM0[4]/U1_DCD)
D20: U100.167(P3[20]/EMC_D[20]/PWM0[5]/U1_DSR)
D21: U100.175(P3[21]/EMC_D[21]/PWM0[6]/U1_DTR)
D22: U100.195(P3[22]/EMC_D[22]/PWM0_CAP0/U1_RI)
D23: U100.65(P3[23]/EMC_D[23]/PWM1_CAP0/T0_CAP0)
D24: U100.58(P3[24]/EMC_D[24]/PWM1[1]/T0_CAP1)
D25: U100.56(P3[25]/EMC_D[25]/PWM1[2]/T0_MAT0)
D26: U100.55(P3[26]/EMC_D[26]/PWM1[3]/T0_MAT1/STCLK)
D27: U100.203(P3[27]/EMC_D[27]/PWM1[4]/T1_CAP0)
D28: U100.5(P3[28]/EMC_D[28]/PWM1[5]/T1_CAP1)
D29: U100.11(P3[29]/EMC_D[29]/PWM1[6]/T1_MAT0)
D30: U100.19(P3[30]/EMC_D[30]/U1_RTS/T1_MAT1)
D31: U100.25(P3[31]/EMC_D[31]/T1_MAT2)
DQM0: U100.49(P2[28]/EMC_DQM0) ; off-sheet DQM0
DQM1: U100.43(P2[29]/EMC_DQM1) ; off-sheet DQM1
DQM2: U100.31(P2[30]/EMC_DQM2/I2C2_SDA/T3_MAT2) ; off-sheet DQM2
DQM3: U100.39(P2[31]/EMC_DQM3/I2C2_SCL/T3_MAT3) ; off-sheet DQM3
DYCS0#: U100.73(P2[20]/#EMC_DYCS0) ; off-sheet DYCS0#
EMC_CAS#: U100.87(P2[16]/#EMC_CAS) ; off-sheet EMC_CAS#
EMC_CKE0: U100.53(P2[24]/EMC_CKE0) ; off-sheet EMC_CKE0
EMC_CLK0: U100.59(P2[18]/EMC_CLK[0]) ; off-sheet EMC_CLK0
EMC_CS2#: U100.91(P2[14]/#EMC_CS2/I2C1_SDA/T2_CAP0) ; off-sheet EMC_CS2#
EMC_CS3#: U100.99(P2[15]/#EMC_CS3/I2C1_SCL/T2_CAP1) ; off-sheet EMC_CS3#
EMC_RAS#: U100.95(P2[17]/#EMC_RAS) ; off-sheet EMC_RAS#
LCD_DCLK: U100.150(P2[2]/PWM1[3]/U1_CTS/T2_MAT3/TRACEDATA[3]/LCD_DCLK) ; off-sheet LCD_DCLK
LCD_EN: U100.142(P2[4]/PWM1[5]/U1_DSR/T2_MAT1/TRACEDATA[1]/LCD_ENAB_M) ; off-sheet LCD_EN
LCD_FP: U100.144(P2[3]/PWM1[4]/U1_DCD/T2_MAT2/TRACEDATA[2]/LCD_FP) ; off-sheet LCD_FP
LCD_LE: U100.152(P2[1]/PWM1[2]/U1_RXD/LCD_LE) ; off-sheet LCD_LE
LCD_LP: U100.140(P2[5]/PWM1[6]/U1_DTR/T2_MAT0/TRACEDATA[0]/LCD_LP) ; off-sheet LCD_LP
P2_10: U100.110(P2[10]/EINT0/NMI) ; off-sheet P2_10
P2_11: U100.108(P2[11]/EINT1/SD_DAT[1]/I2S_TX_SCK/LCD_CLKIN) ; off-sheet P2_11
P2_19: U100.67(P2[19]/EMC_CLK[1]) ; off-sheet P2_19
P2_21: U100.81(P2[21]/#EMC_DYCS1) ; off-sheet P2_21
P2_25: U100.54(P2[25]/EMC_CKE1) ; off-sheet P2_25
PWM1_1: U100.154(P2[0]/PWM1[1]/U1_TXD/LCD_PWR) ; off-sheet PWM1_1
SSP0_MISO: U100.57(P2[26]/EMC_CKE2/SSP0_MISO/T3_MAT0) ; off-sheet SSP0_MISO
SSP0_MOSI: U100.47(P2[27]/EMC_CKE3/SSP0_MOSI/T3_MAT1) ; off-sheet SSP0_MOSI
SSP0_SCK: U100.85(P2[22]/#EMC_DYCS2/SSP0_SCK/T3_CAP0) ; off-sheet SSP0_SCK
SSP0_SSEL: U100.64(P2[23]/#EMC_DYCS3/SSP0_SSEL/T3_CAP1) ; off-sheet SSP0_SSEL
VD4: U100.138(P2[6]/PWM1_CAP0/U1_RI/T2_CAP0/U2_OE/TRACECLK/LCD_VD[0]/LCD_VD[4]) ; off-sheet VD4
VD5: U100.136(P2[7]/CAN_RD2/U1_RTS/LCD_VD[1]/LCD_VD[5]) ; off-sheet VD5
VD6: U100.134(P2[8]/CAN_TD2/U2_TXD/U1_CTS/ENET_MDC/LCD_VD[2]/LCD_VD[6]) ; off-sheet VD6
VD7: U100.132(P2[9]/USB_CONNECT1/U2_RXD/U4_RXD/ENET_MDIO/LCD_VD[3]/LCD_VD[7]) ; off-sheet VD7
VD18: U100.106(P2[12]/EINT2/SD_DAT[2]/I2S_TX_WS/LCD_VD[4]/LCD_VD[3]/LCD_VD[8]/LCD_VD[18]) ; off-sheet VD18
VD19: U100.102(P2[13]/EINT3/SD_DAT[3]/I2S_TX_SDA/LCD_VD[5]/LCD_VD[9]/LCD_VD[19]) ; off-sheet VD19

### Notes on the sheet
- ISP
- (in symbol My Title 0) Title:; Size:; Document Number:; Rev:; Draw By:; Date:; Sheet:; of

### Library data of the parts
*#6 = My Title 0: Page Create Date: May 29, 2006; WebSite: http://www.ucdragon.com

## Sheet 01)CPU-1.SchDoc
size 297 x 209 mm
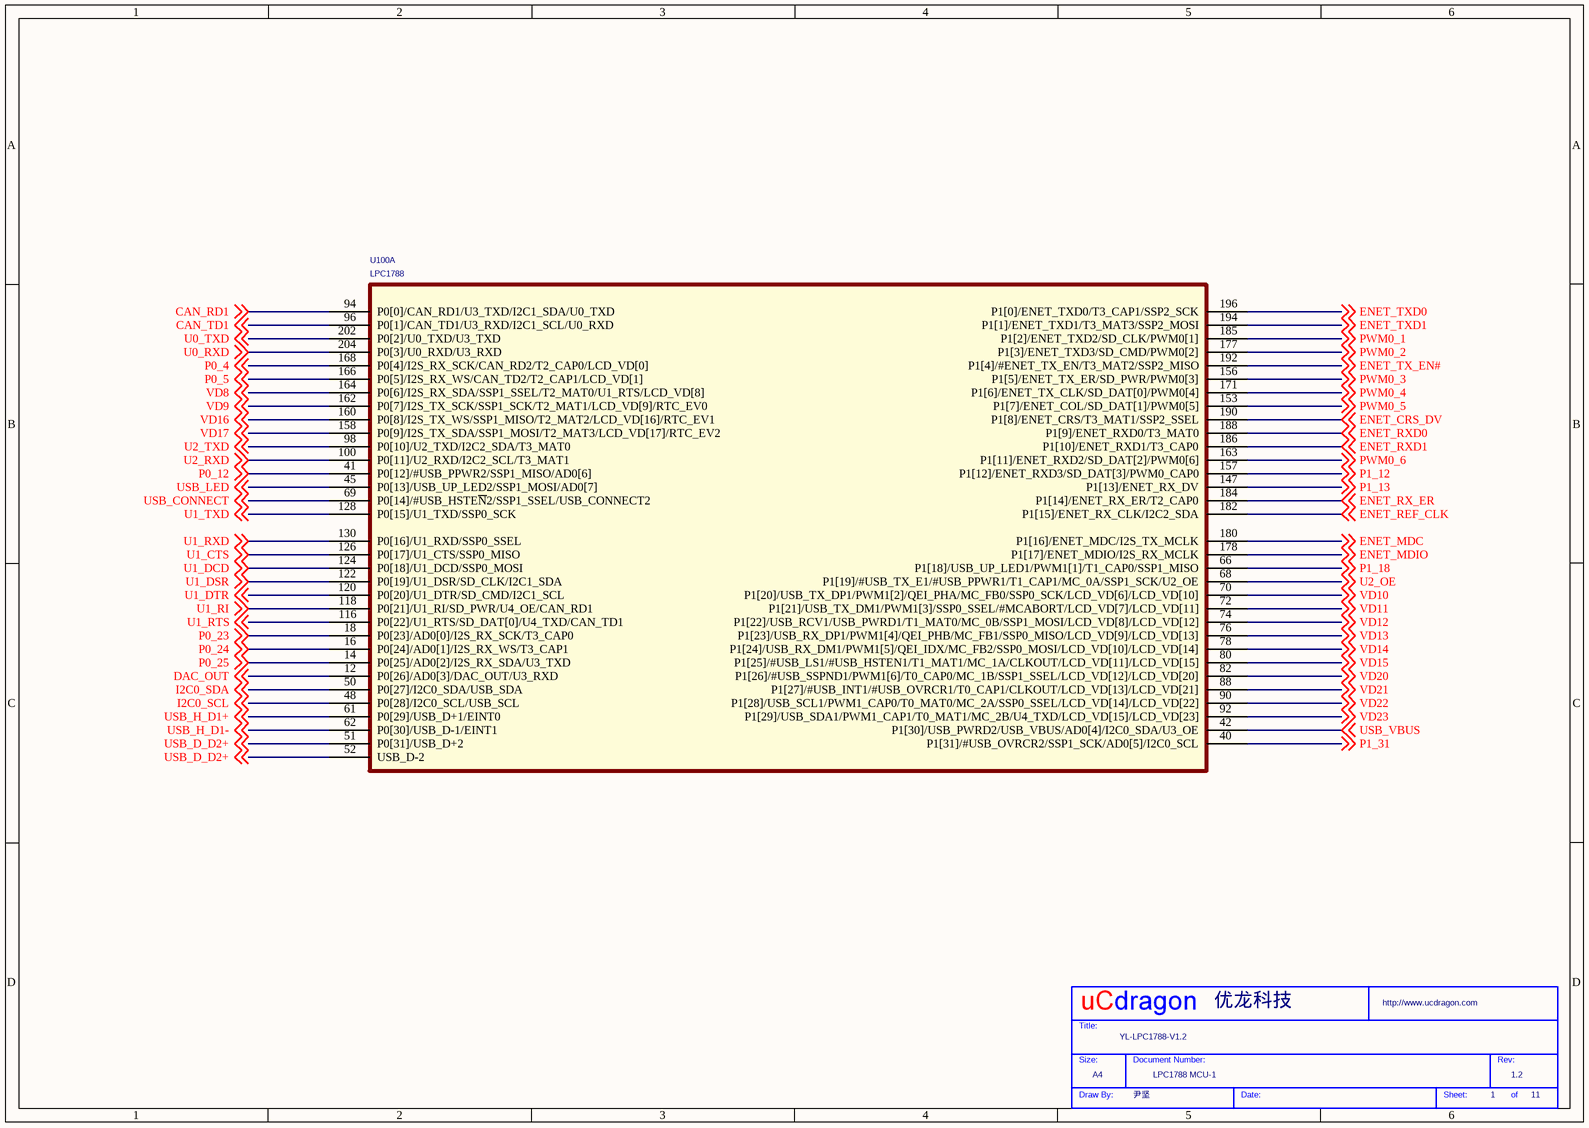
[diagram p7: 01)CPU-1.SchDoc]

### Parts
(Parts that share a designator on the sheet are numbered #1, #2 ... from top to bottom, then left to right.)
*#7  Page Count: 11  Page Number: 1  Page Size: A4  Title: YL-LPC1788-V1.2  RevCode: 1.2  Doc: LPC1788 MCU-1  Drawing: 尹坚  Company: 优龙科技  (hidden comment: My Title 0)  (graphical)
U100  LPC1788  [LQFP208_28X28X05P]  (part A of 3)

### Nets
CAN_RD1: U100.94(P0[0]/CAN_RD1/U3_TXD/I2C1_SDA/U0_TXD) ; off-sheet CAN_RD1
CAN_TD1: U100.96(P0[1]/CAN_TD1/U3_RXD/I2C1_SCL/U0_RXD) ; off-sheet CAN_TD1
DAC_OUT: U100.12(P0[26]/AD0[3]/DAC_OUT/U3_RXD) ; off-sheet DAC_OUT
ENET_CRS_DV: U100.190(P1[8]/ENET_CRS/T3_MAT1/SSP2_SSEL) ; off-sheet ENET_CRS_DV
ENET_MDC: U100.180(P1[16]/ENET_MDC/I2S_TX_MCLK) ; off-sheet ENET_MDC
ENET_MDIO: U100.178(P1[17]/ENET_MDIO/I2S_RX_MCLK) ; off-sheet ENET_MDIO
ENET_REF_CLK: U100.182(P1[15]/ENET_RX_CLK/I2C2_SDA) ; off-sheet ENET_REF_CLK
ENET_RX_ER: U100.184(P1[14]/ENET_RX_ER/T2_CAP0) ; off-sheet ENET_RX_ER
ENET_RXD0: U100.188(P1[9]/ENET_RXD0/T3_MAT0) ; off-sheet ENET_RXD0
ENET_RXD1: U100.186(P1[10]/ENET_RXD1/T3_CAP0) ; off-sheet ENET_RXD1
ENET_TX_EN#: U100.192(P1[4]/#ENET_TX_EN/T3_MAT2/SSP2_MISO) ; off-sheet ENET_TX_EN#
ENET_TXD0: U100.196(P1[0]/ENET_TXD0/T3_CAP1/SSP2_SCK) ; off-sheet ENET_TXD0
ENET_TXD1: U100.194(P1[1]/ENET_TXD1/T3_MAT3/SSP2_MOSI) ; off-sheet ENET_TXD1
I2C0_SCL: U100.48(P0[28]/I2C0_SCL/USB_SCL) ; off-sheet I2C0_SCL
I2C0_SDA: U100.50(P0[27]/I2C0_SDA/USB_SDA) ; off-sheet I2C0_SDA
P0_4: U100.168(P0[4]/I2S_RX_SCK/CAN_RD2/T2_CAP0/LCD_VD[0]) ; off-sheet P0_4
P0_5: U100.166(P0[5]/I2S_RX_WS/CAN_TD2/T2_CAP1/LCD_VD[1]) ; off-sheet P0_5
P0_12: U100.41(P0[12]/#USB_PPWR2/SSP1_MISO/AD0[6]) ; off-sheet P0_12
P0_23: U100.18(P0[23]/AD0[0]/I2S_RX_SCK/T3_CAP0) ; off-sheet P0_23
P0_24: U100.16(P0[24]/AD0[1]/I2S_RX_WS/T3_CAP1) ; off-sheet P0_24
P0_25: U100.14(P0[25]/AD0[2]/I2S_RX_SDA/U3_TXD) ; off-sheet P0_25
P1_12: U100.157(P1[12]/ENET_RXD3/SD_DAT[3]/PWM0_CAP0) ; off-sheet P1_12
P1_13: U100.147(P1[13]/ENET_RX_DV) ; off-sheet P1_13
P1_18: U100.66(P1[18]/USB_UP_LED1/PWM1[1]/T1_CAP0/SSP1_MISO) ; off-sheet P1_18
P1_31: U100.40(P1[31]/#USB_OVRCR2/SSP1_SCK/AD0[5]/I2C0_SCL) ; off-sheet P1_31
PWM0_1: U100.185(P1[2]/ENET_TXD2/SD_CLK/PWM0[1]) ; off-sheet PWM0_1
PWM0_2: U100.177(P1[3]/ENET_TXD3/SD_CMD/PWM0[2]) ; off-sheet PWM0_2
PWM0_3: U100.156(P1[5]/ENET_TX_ER/SD_PWR/PWM0[3]) ; off-sheet PWM0_3
PWM0_4: U100.171(P1[6]/ENET_TX_CLK/SD_DAT[0]/PWM0[4]) ; off-sheet PWM0_4
PWM0_5: U100.153(P1[7]/ENET_COL/SD_DAT[1]/PWM0[5]) ; off-sheet PWM0_5
PWM0_6: U100.163(P1[11]/ENET_RXD2/SD_DAT[2]/PWM0[6]) ; off-sheet PWM0_6
U0_RXD: U100.204(P0[3]/U0_RXD/U3_RXD) ; off-sheet U0_RXD
U0_TXD: U100.202(P0[2]/U0_TXD/U3_TXD) ; off-sheet U0_TXD
U1_CTS: U100.126(P0[17]/U1_CTS/SSP0_MISO) ; off-sheet U1_CTS
U1_DCD: U100.124(P0[18]/U1_DCD/SSP0_MOSI) ; off-sheet U1_DCD
U1_DSR: U100.122(P0[19]/U1_DSR/SD_CLK/I2C1_SDA) ; off-sheet U1_DSR
U1_DTR: U100.120(P0[20]/U1_DTR/SD_CMD/I2C1_SCL) ; off-sheet U1_DTR
U1_RI: U100.118(P0[21]/U1_RI/SD_PWR/U4_OE/CAN_RD1) ; off-sheet U1_RI
U1_RTS: U100.116(P0[22]/U1_RTS/SD_DAT[0]/U4_TXD/CAN_TD1) ; off-sheet U1_RTS
U1_RXD: U100.130(P0[16]/U1_RXD/SSP0_SSEL) ; off-sheet U1_RXD
U1_TXD: U100.128(P0[15]/U1_TXD/SSP0_SCK) ; off-sheet U1_TXD
U2_OE: U100.68(P1[19]/#USB_TX_E1/#USB_PPWR1/T1_CAP1/MC_0A/SSP1_SCK/U2_OE) ; off-sheet U2_OE
U2_RXD: U100.100(P0[11]/U2_RXD/I2C2_SCL/T3_MAT1) ; off-sheet U2_RXD
U2_TXD: U100.98(P0[10]/U2_TXD/I2C2_SDA/T3_MAT0) ; off-sheet U2_TXD
USB_CONNECT: U100.69(P0[14]/#USB_HSTE~{N}2/SSP1_SSEL/USB_CONNECT2) ; off-sheet USB_CONNECT
USB_D_D2+: U100.51(P0[31]/USB_D+2) U100.52(USB_D-2) ; off-sheet USB_D_D2+
USB_H_D1+: U100.61(P0[29]/USB_D+1/EINT0) ; off-sheet USB_H_D1+  [project net USB_D_P]
USB_H_D1-: U100.62(P0[30]/USB_D-1/EINT1) ; off-sheet USB_H_D1-  [project net USB_D_N]
USB_LED: U100.45(P0[13]/USB_UP_LED2/SSP1_MOSI/AD0[7]) ; off-sheet USB_LED
USB_VBUS: U100.42(P1[30]/USB_PWRD2/USB_VBUS/AD0[4]/I2C0_SDA/U3_OE) ; off-sheet USB_VBUS
VD8: U100.164(P0[6]/I2S_RX_SDA/SSP1_SSEL/T2_MAT0/U1_RTS/LCD_VD[8]) ; off-sheet VD8
VD9: U100.162(P0[7]/I2S_TX_SCK/SSP1_SCK/T2_MAT1/LCD_VD[9]/RTC_EV0) ; off-sheet VD9
VD10: U100.70(P1[20]/USB_TX_DP1/PWM1[2]/QEI_PHA/MC_FB0/SSP0_SCK/LCD_VD[6]/LCD_VD[10]) ; off-sheet VD10
VD11: U100.72(P1[21]/USB_TX_DM1/PWM1[3]/SSP0_SSEL/#MCABORT/LCD_VD[7]/LCD_VD[11]) ; off-sheet VD11
VD12: U100.74(P1[22]/USB_RCV1/USB_PWRD1/T1_MAT0/MC_0B/SSP1_MOSI/LCD_VD[8]/LCD_VD[12]) ; off-sheet VD12
VD13: U100.76(P1[23]/USB_RX_DP1/PWM1[4]/QEI_PHB/MC_FB1/SSP0_MISO/LCD_VD[9]/LCD_VD[13]) ; off-sheet VD13
VD14: U100.78(P1[24]/USB_RX_DM1/PWM1[5]/QEI_IDX/MC_FB2/SSP0_MOSI/LCD_VD[10]/LCD_VD[14]) ; off-sheet VD14
VD15: U100.80(P1[25]/#USB_LS1/#USB_HSTEN1/T1_MAT1/MC_1A/CLKOUT/LCD_VD[11]/LCD_VD[15]) ; off-sheet VD15
VD16: U100.160(P0[8]/I2S_TX_WS/SSP1_MISO/T2_MAT2/LCD_VD[16]/RTC_EV1) ; off-sheet VD16
VD17: U100.158(P0[9]/I2S_TX_SDA/SSP1_MOSI/T2_MAT3/LCD_VD[17]/RTC_EV2) ; off-sheet VD17
VD20: U100.82(P1[26]/#USB_SSPND1/PWM1[6]/T0_CAP0/MC_1B/SSP1_SSEL/LCD_VD[12]/LCD_VD[20]) ; off-sheet VD20
VD21: U100.88(P1[27]/#USB_INT1/#USB_OVRCR1/T0_CAP1/CLKOUT/LCD_VD[13]/LCD_VD[21]) ; off-sheet VD21
VD22: U100.90(P1[28]/USB_SCL1/PWM1_CAP0/T0_MAT0/MC_2A/SSP0_SSEL/LCD_VD[14]/LCD_VD[22]) ; off-sheet VD22
VD23: U100.92(P1[29]/USB_SDA1/PWM1_CAP1/T0_MAT1/MC_2B/U4_TXD/LCD_VD[15]/LCD_VD[23]) ; off-sheet VD23

### Notes on the sheet
- (in symbol My Title 0) Title:; Size:; Document Number:; Rev:; Draw By:; Date:; Sheet:; of

### Library data of the parts
*#7 = My Title 0: Page Create Date: May 29, 2006; WebSite: http://www.ucdragon.com

## Sheet 11)KEY,LED.SchDoc
size 297 x 209 mm
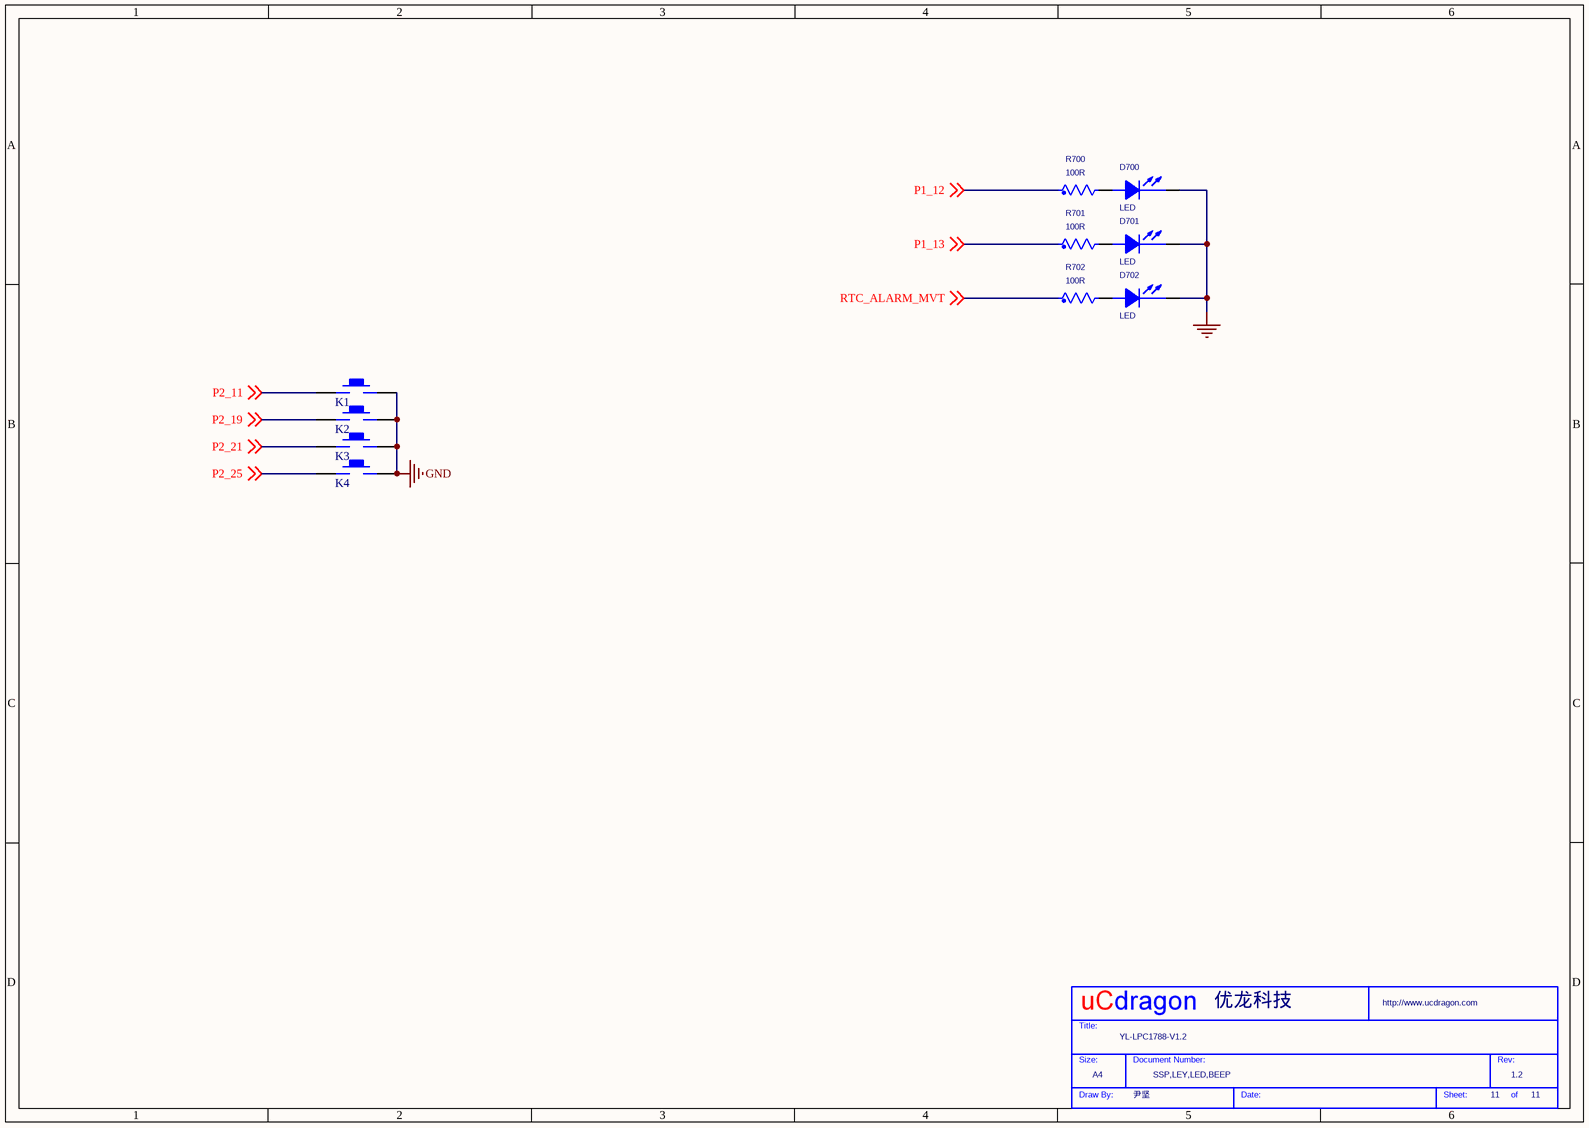
[diagram p8: 11)KEY,LED.SchDoc]

### Parts
(Parts that share a designator on the sheet are numbered #1, #2 ... from top to bottom, then left to right.)
*#8  Page Count: 11  Page Size: A4  Title: YL-LPC1788-V1.2  RevCode: 1.2  Doc: SSP,LEY,LED,BEEP  Drawing: 尹坚  Company: 优龙科技  (hidden comment: My Title 0)  (graphical)
D700  LED  [SMDLED]
D701  LED  [SMDLED]
D702  LED  [SMDLED]
K1  KEY_M  [K贴片]  (value not drawn)
K2  KEY_M  [K贴片]  (value not drawn)
K3  KEY_M  [K贴片]  (value not drawn)
K4  KEY_M  [K贴片]  (value not drawn)
R700  100R  [0603P]
R701  100R  [0603P]
R702  100R  [0603P]

### Nets
GND: K1.1 K2.1 K3.1 K4.1
GND_POWER: D700.2(CATHODE) D701.2(CATHODE) D702.2(CATHODE)
P1_12: R700.1 ; off-sheet P1_12
P1_13: R701.1 ; off-sheet P1_13
P2_11: K1.2 ; off-sheet P2_11
P2_19: K2.2 ; off-sheet P2_19
P2_21: K3.2 ; off-sheet P2_21
P2_25: K4.2 ; off-sheet P2_25
RTC_ALARM_MVT: R702.1 ; off-sheet RTC_ALARM_MVT
NetD700_1: D700.1(ANODE) R700.2
NetD701_1: D701.1(ANODE) R701.2
NetD702_1: D702.1(ANODE) R702.2

### Notes on the sheet
- (in symbol My Title 0) Title:; Size:; Document Number:; Rev:; Draw By:; Date:; Sheet:; of

### Library data of the parts
R700-R702 = R_Generic_Dup2
*#8 = My Title 0: Page Number: 11; Page Create Date: May 29, 2006; WebSite: http://www.ucdragon.com

## Nets that join several sheets
+3V3: 07)Power,JTAG,RESET (9 pins), 06)LCD (15 pins), 05)NorFlash,NandFlash (11 pins), 04)SDRAM (29 pins), 03)CPU-3 (25 pins)
GND: 10)USB HOST,USB Device, (5 pins), 07)Power,JTAG,RESET (11 pins), 06)LCD (53 pins), 11)KEY,LED (K1.1 K2.1 K3.1 K4.1)
GND_POWER: 07)Power,JTAG,RESET (16 pins), 05)NorFlash,NandFlash (7 pins), 04)SDRAM (28 pins), 03)CPU-3 (28 pins), 11)KEY,LED (D700.2 D701.2 D702.2)
VCC5V: 10)USB HOST,USB Device, (D9.2), 07)Power,JTAG,RESET (6 pins), 06)LCD (12 pins)
A0: 04)SDRAM (U200.23 U201.23), 03)CPU-3 (U100.75)
A1: 04)SDRAM (U200.24 U201.24), 03)CPU-3 (U100.79)
A2: 04)SDRAM (U200.25 U201.25), 03)CPU-3 (U100.83)
A3: 04)SDRAM (U200.26 U201.26), 03)CPU-3 (U100.97)
A4: 04)SDRAM (U200.29 U201.29), 03)CPU-3 (U100.103)
A5: 04)SDRAM (U200.30 U201.30), 03)CPU-3 (U100.107)
A6: 04)SDRAM (U200.31 U201.31), 03)CPU-3 (U100.113)
A7: 04)SDRAM (U200.32 U201.32), 03)CPU-3 (U100.121)
A8: 04)SDRAM (U200.33 U201.33), 03)CPU-3 (U100.127)
A9: 04)SDRAM (U200.34 U201.34), 03)CPU-3 (U100.131)
A10: 04)SDRAM (U200.22 U201.22), 03)CPU-3 (U100.135)
A11: 04)SDRAM (U200.35 U201.35), 03)CPU-3 (U100.145)
A12: 04)SDRAM (U200.36 U201.36), 03)CPU-3 (U100.149)
A13: 04)SDRAM (U200.20 U201.20), 03)CPU-3 (U100.155)
A14: 04)SDRAM (U200.21 U201.21), 03)CPU-3 (U100.159)
A19: 05)NorFlash,NandFlash (U300.17), 03)CPU-3 (U100.111)
A20: 05)NorFlash,NandFlash (U300.16), 03)CPU-3 (U100.109)
CS1#: 05)NorFlash,NandFlash (R309.2), 03)CPU-3 (U100.193)
D0: 05)NorFlash,NandFlash (U300.29), 04)SDRAM (U200.2), 02)CPU-2 (U100.197)
D1: 05)NorFlash,NandFlash (U300.30), 04)SDRAM (U200.4), 02)CPU-2 (U100.201)
D2: 05)NorFlash,NandFlash (U300.31), 04)SDRAM (U200.5), 02)CPU-2 (U100.207)
D3: 05)NorFlash,NandFlash (U300.32), 04)SDRAM (U200.7), 02)CPU-2 (U100.3)
D4: 05)NorFlash,NandFlash (U300.41), 04)SDRAM (U200.8), 02)CPU-2 (U100.13)
D5: 05)NorFlash,NandFlash (U300.42), 04)SDRAM (U200.10), 02)CPU-2 (U100.17)
D6: 05)NorFlash,NandFlash (U300.43), 04)SDRAM (U200.11), 02)CPU-2 (U100.23)
D7: 05)NorFlash,NandFlash (U300.44), 04)SDRAM (U200.13), 02)CPU-2 (U100.27)
D8: 04)SDRAM (U200.42), 02)CPU-2 (U100.191)
D9: 04)SDRAM (U200.44), 02)CPU-2 (U100.199)
D10: 04)SDRAM (U200.45), 02)CPU-2 (U100.205)
D11: 04)SDRAM (U200.47), 02)CPU-2 (U100.208)
D12: 04)SDRAM (U200.48), 02)CPU-2 (U100.1)
D13: 04)SDRAM (U200.50), 02)CPU-2 (U100.7)
D14: 05)NorFlash,NandFlash (R306.2), 04)SDRAM (U200.51), 02)CPU-2 (U100.21)
D15: 05)NorFlash,NandFlash (R310.1), 04)SDRAM (U200.53), 02)CPU-2 (U100.28)
D16: 04)SDRAM (U201.2), 02)CPU-2 (U100.137)
D17: 04)SDRAM (U201.4), 02)CPU-2 (U100.143)
D18: 04)SDRAM (U201.5), 02)CPU-2 (U100.151)
D19: 04)SDRAM (U201.7), 02)CPU-2 (U100.161)
D20: 04)SDRAM (U201.8), 02)CPU-2 (U100.167)
D21: 04)SDRAM (U201.10), 02)CPU-2 (U100.175)
D22: 04)SDRAM (U201.11), 02)CPU-2 (U100.195)
D23: 04)SDRAM (U201.13), 02)CPU-2 (U100.65)
D24: 04)SDRAM (U201.42), 02)CPU-2 (U100.58)
D25: 04)SDRAM (U201.44), 02)CPU-2 (U100.56)
D26: 04)SDRAM (U201.45), 02)CPU-2 (U100.55)
D27: 04)SDRAM (U201.47), 02)CPU-2 (U100.203)
D28: 04)SDRAM (U201.48), 02)CPU-2 (U100.5)
D29: 04)SDRAM (U201.50), 02)CPU-2 (U100.11)
D30: 04)SDRAM (U201.51), 02)CPU-2 (U100.19)
D31: 04)SDRAM (U201.53), 02)CPU-2 (U100.25)
DQM0: 04)SDRAM (U200.15), 02)CPU-2 (U100.49)
DQM1: 04)SDRAM (U200.39), 02)CPU-2 (U100.43)
DQM2: 04)SDRAM (U201.15), 02)CPU-2 (U100.31)
DQM3: 04)SDRAM (U201.39), 02)CPU-2 (U100.39)
DYCS0#: 04)SDRAM (R200.1 U200.19 U201.19), 02)CPU-2 (U100.73)
EMC_CAS#: 04)SDRAM (U200.17 U201.17), 02)CPU-2 (U100.87)
EMC_CKE0: 04)SDRAM (U200.37 U201.37), 02)CPU-2 (U100.53)
EMC_CLK0: 04)SDRAM (U200.38 U201.38), 02)CPU-2 (U100.59)
EMC_RAS#: 04)SDRAM (U200.18 U201.18), 02)CPU-2 (U100.95)
EMC_WE#: 05)NorFlash,NandFlash (U300.18), 04)SDRAM (U200.16 U201.16), 03)CPU-3 (U100.179)
LCD_DCLK: 06)LCD (U3.31), 02)CPU-2 (U100.150)
LCD_EN: 06)LCD (U3.30), 02)CPU-2 (U100.142)
LCD_FP: 06)LCD (U3.28), 02)CPU-2 (U100.144)
LCD_LP: 06)LCD (U3.27), 02)CPU-2 (U100.140)
nNand_CS#: 05)NorFlash,NandFlash (R308.2 U300.9), 03)CPU-3 (U100.187)
nNand_RE#: 05)NorFlash,NandFlash (U300.8), 03)CPU-3 (U100.183)
NRST: 07)Power,JTAG,RESET (CON500.15 R36.2 R510.2), 03)CPU-3 (U100.35)
P0_4: 06)LCD (U3.51), 01)CPU-1 (U100.168)
P0_5: 06)LCD (U3.52), 01)CPU-1 (U100.166)
P1_12: 01)CPU-1 (U100.157), 11)KEY,LED (R700.1)
P1_13: 01)CPU-1 (U100.147), 11)KEY,LED (R701.1)
P2_11: 02)CPU-2 (U100.108), 11)KEY,LED (K1.2)
P2_19: 02)CPU-2 (U100.67), 11)KEY,LED (K2.2)
P2_21: 02)CPU-2 (U100.81), 11)KEY,LED (K3.2)
P2_25: 02)CPU-2 (U100.54), 11)KEY,LED (K4.2)
RTC_ALARM_MVT: 03)CPU-3 (U100.37), 11)KEY,LED (R702.1)
TCK(SWDCLK): 07)Power,JTAG,RESET (CON500.9 R505.1), 03)CPU-3 (U100.10)
TDI: 07)Power,JTAG,RESET (CON500.5 R501.2), 03)CPU-3 (U100.4)
TDO(SWO): 07)Power,JTAG,RESET (CON500.13 R504.2), 03)CPU-3 (U100.2)
TMS(SWDIO): 07)Power,JTAG,RESET (CON500.7 R502.2), 03)CPU-3 (U100.6)
TRST#: 07)Power,JTAG,RESET (CON500.3 R500.2), 03)CPU-3 (U100.8)
USB_D_N: 10)USB HOST,USB Device, (R58.2), 01)CPU-1 (U100.62)
USB_D_P: 10)USB HOST,USB Device, (R59.2), 01)CPU-1 (U100.61)
VD2: 06)LCD (U3.54), 03)CPU-3 (U100.170)
VD3: 06)LCD (U3.55), 03)CPU-3 (U100.176)
VD4: 06)LCD (U3.56), 02)CPU-2 (U100.138)
VD5: 06)LCD (U3.3), 02)CPU-2 (U100.136)
VD6: 06)LCD (U3.50), 02)CPU-2 (U100.134)
VD7: 06)LCD (U3.2), 02)CPU-2 (U100.132)
VD8: 06)LCD (U3.4), 01)CPU-1 (U100.164)
VD9: 06)LCD (U3.6), 01)CPU-1 (U100.162)
VD10: 06)LCD (U3.7), 01)CPU-1 (U100.70)
VD11: 06)LCD (U3.11), 01)CPU-1 (U100.72)
VD12: 06)LCD (U3.12), 01)CPU-1 (U100.74)
VD13: 06)LCD (U3.14), 01)CPU-1 (U100.76)
VD14: 06)LCD (U3.8), 01)CPU-1 (U100.78)
VD15: 06)LCD (U3.10), 01)CPU-1 (U100.80)
VD16: 06)LCD (U3.15), 01)CPU-1 (U100.160)
VD17: 06)LCD (U3.19), 01)CPU-1 (U100.158)
VD18: 06)LCD (U3.20), 02)CPU-2 (U100.106)
VD19: 06)LCD (U3.22), 02)CPU-2 (U100.102)
VD20: 06)LCD (U3.23), 01)CPU-1 (U100.82)
VD21: 06)LCD (U3.24), 01)CPU-1 (U100.88)
VD22: 06)LCD (U3.16), 01)CPU-1 (U100.90)
VD23: 06)LCD (U3.18), 01)CPU-1 (U100.92)